# Altium project PCB_Project.PrjPcb
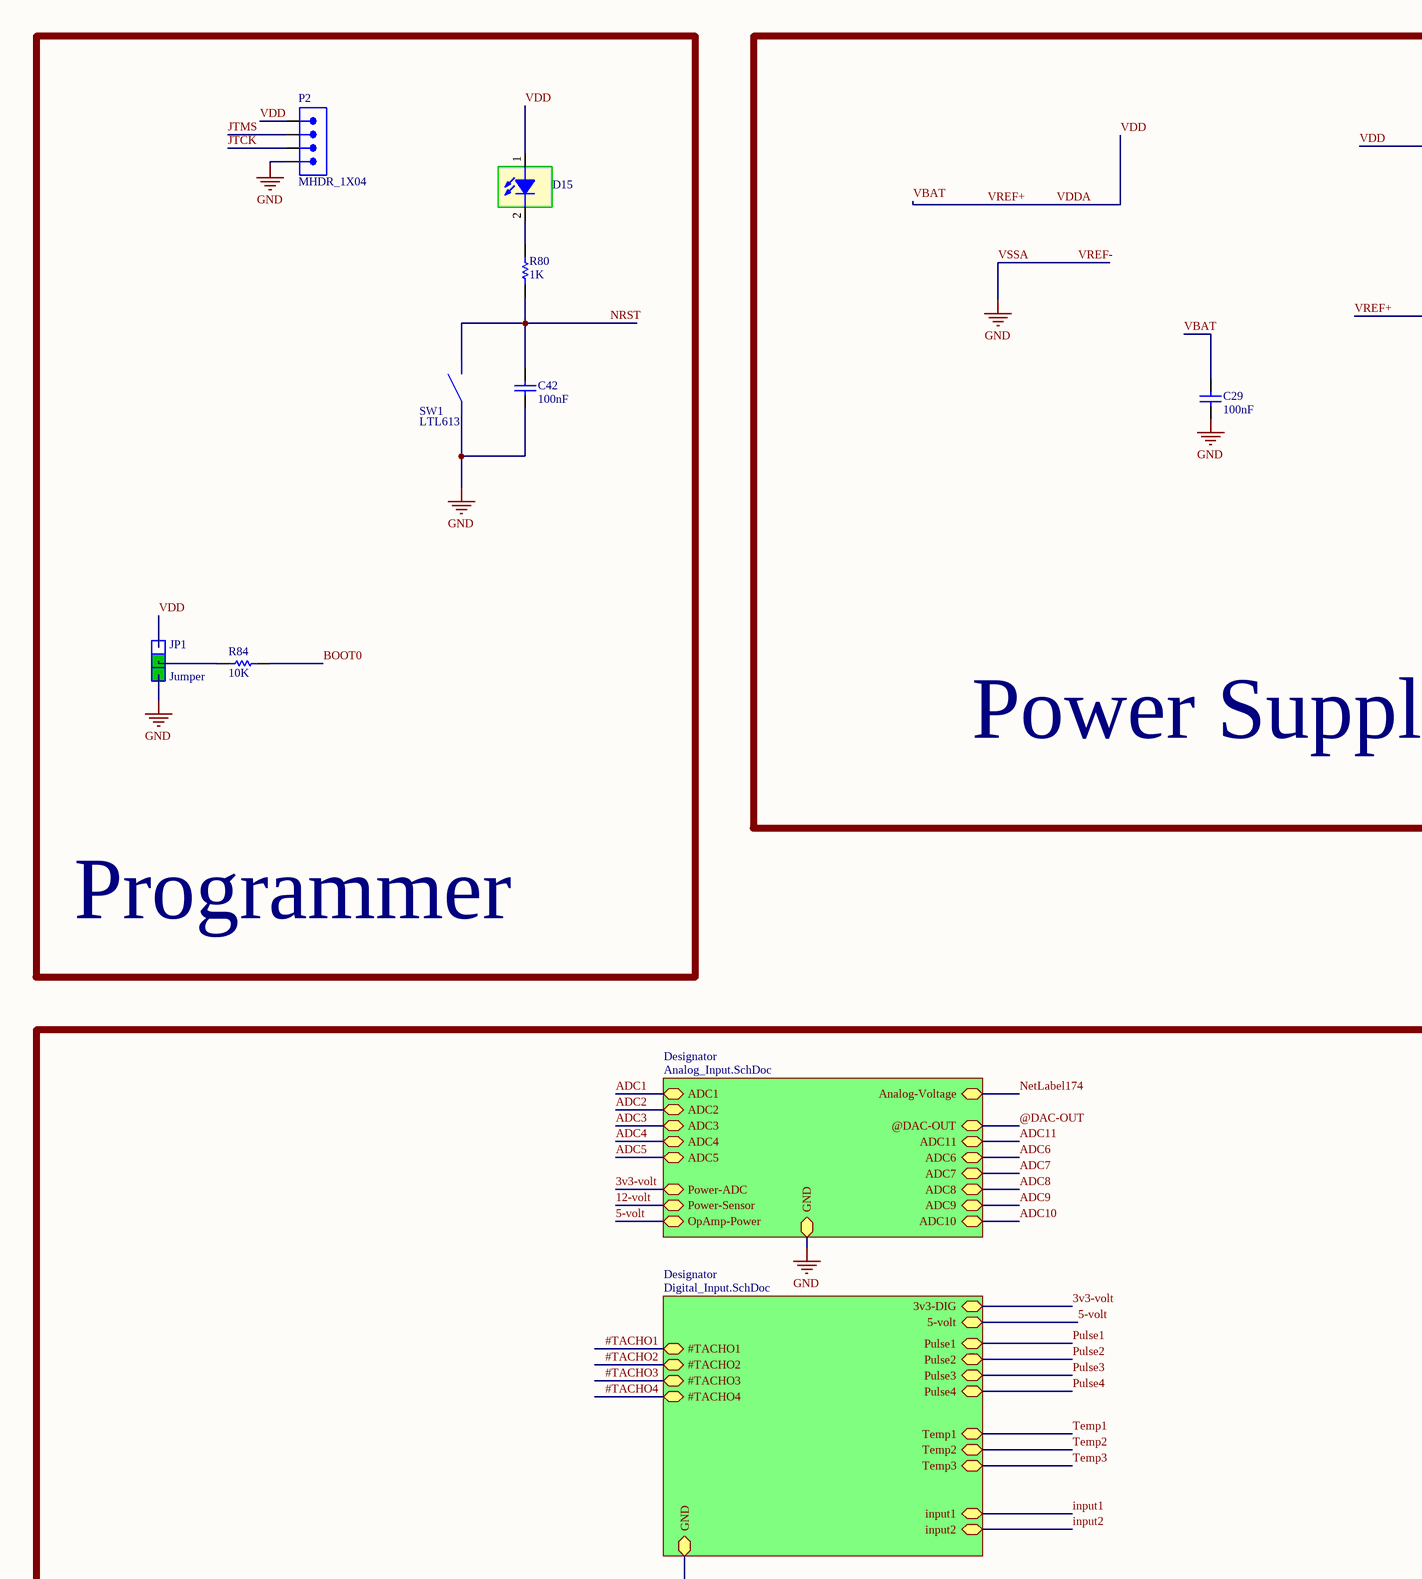
[diagram p0: Main.SchDoc, top left]
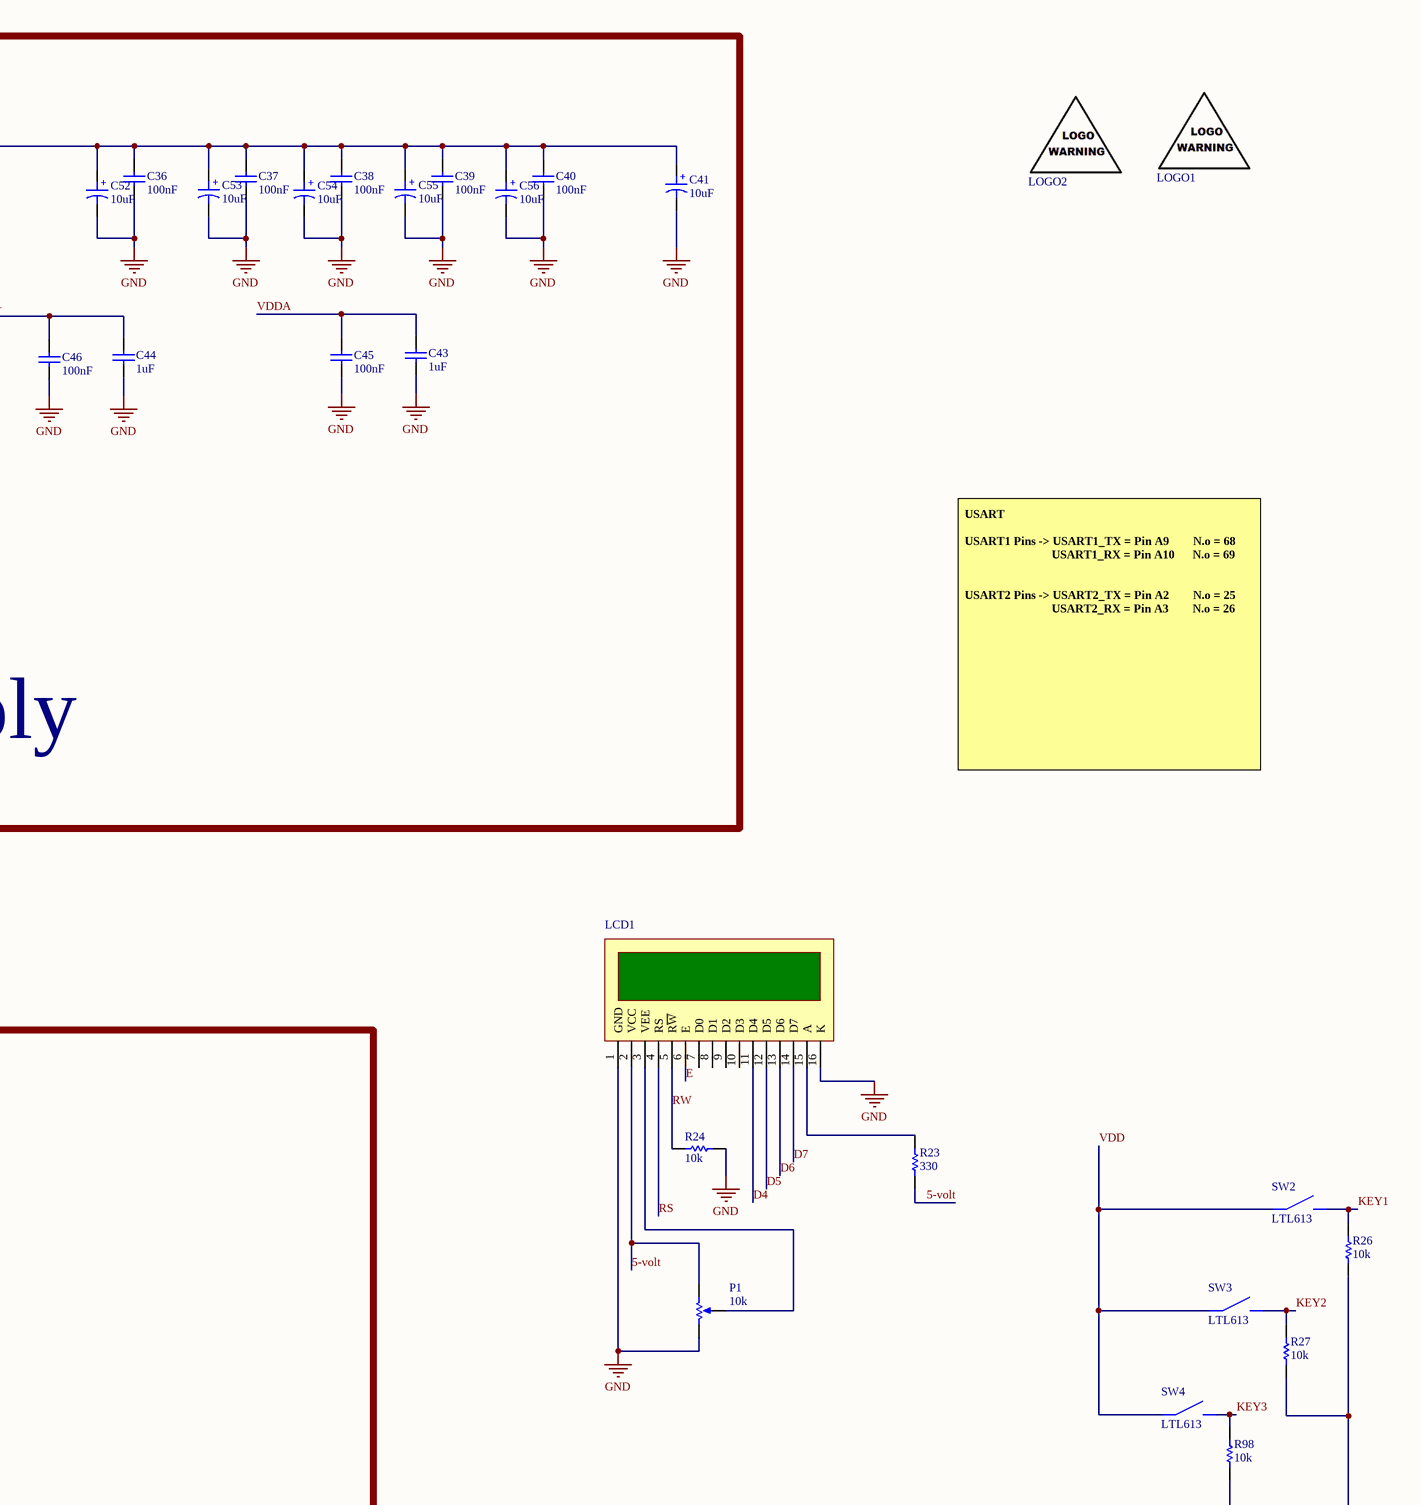
[diagram p1: Main.SchDoc, top right]
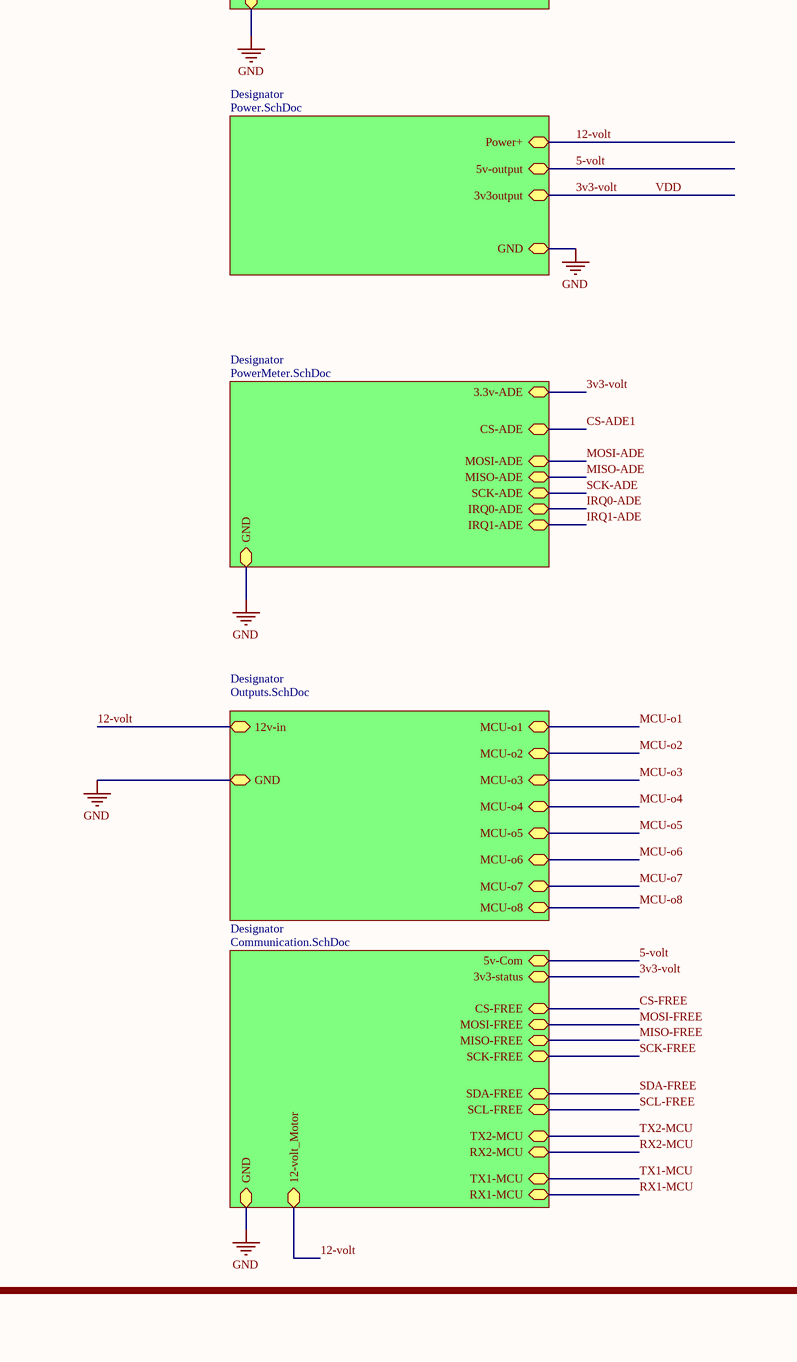
[diagram p2: Main.SchDoc, bottom left]
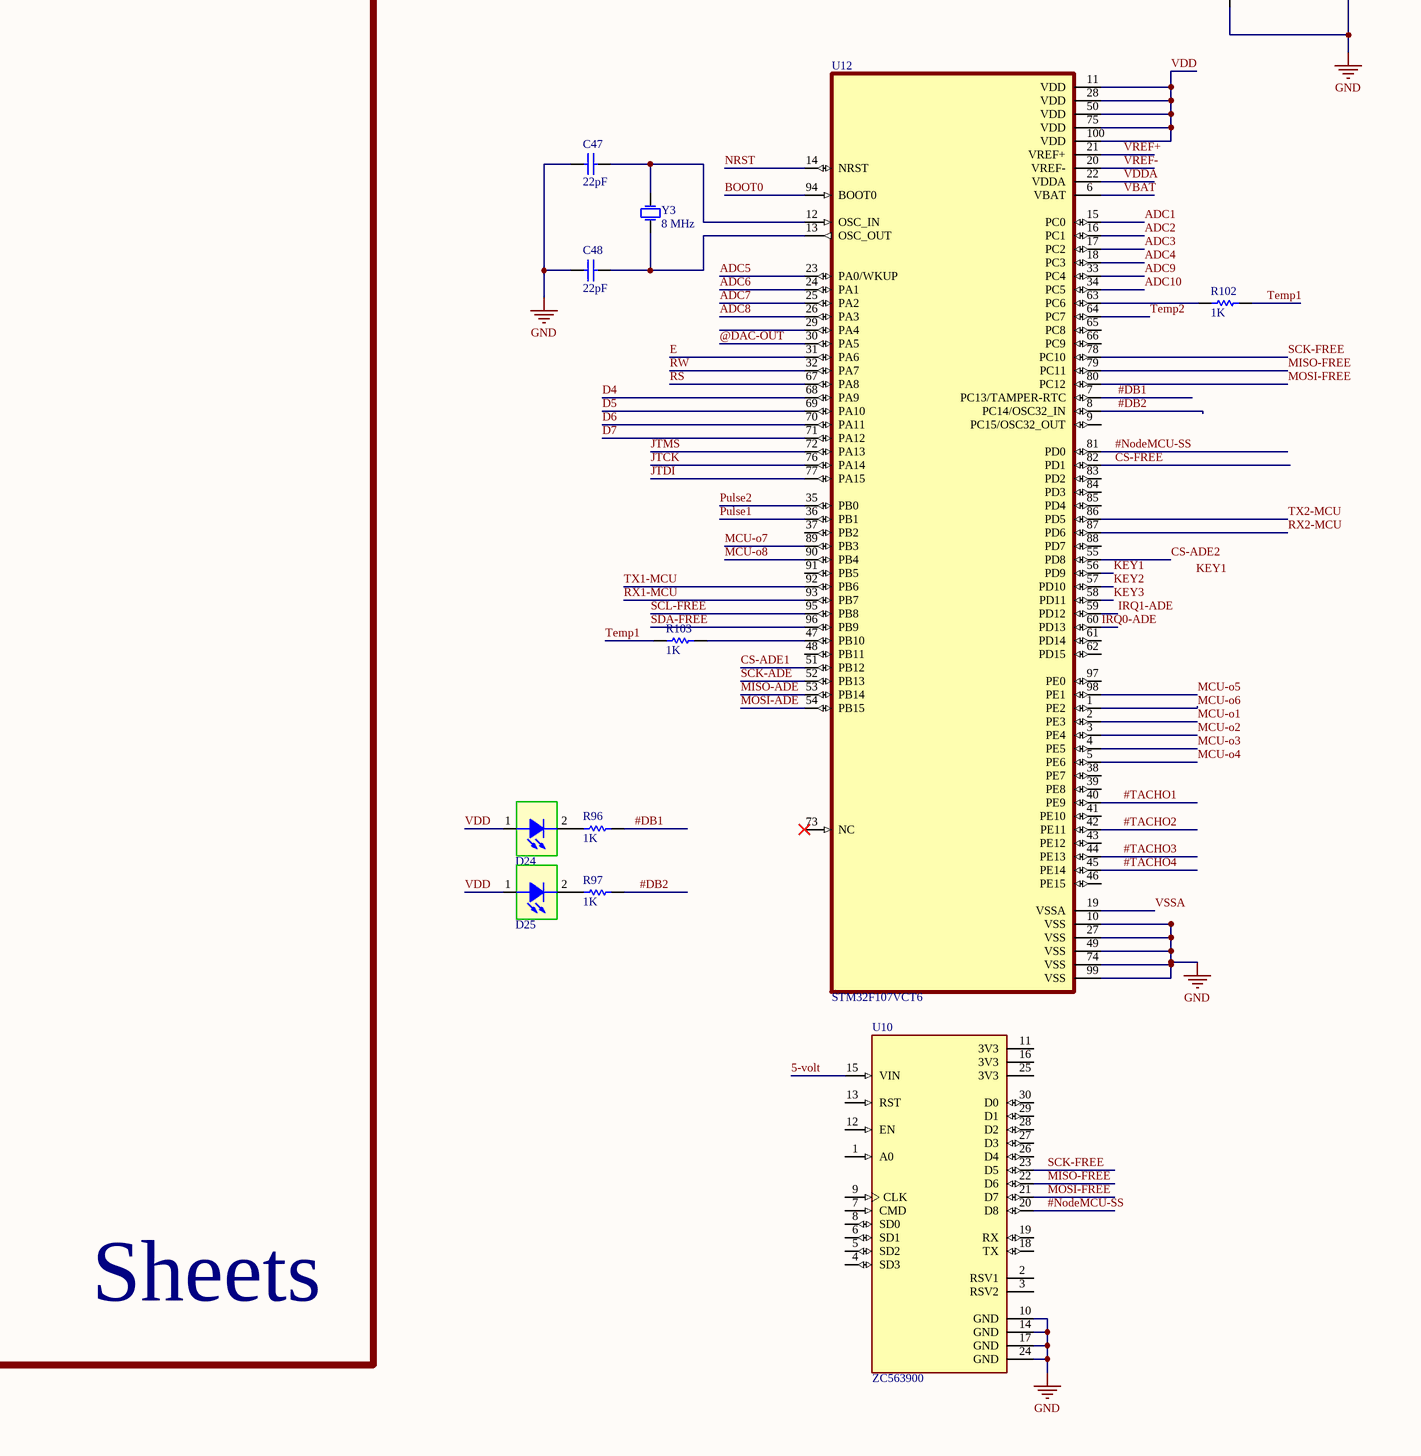
[diagram p3: Main.SchDoc, bottom right]
7 sheets, 298 parts. Net scope: hierarchical (ports join the sheet entries above them; power ports are global).
Board file: MainPCB.PcbDoc
Sheets:
  Main.SchDoc
    Designator = PowerMeter.SchDoc
    Designator = Outputs.SchDoc
    Designator = Analog_Input.SchDoc
    Designator = Digital_Input.SchDoc
    Designator = Power.SchDoc
    Designator = Communication.SchDoc

## Sheet Main.SchDoc
size 549 x 549 mm

### Parts
C29  100nF  [0805_C]
C36  100nF  [0805_C]
C37  100nF  [0805_C]
C38  100nF  [0805_C]
C39  100nF  [0805_C]
C40  100nF  [0805_C]
C41  10uF  [Cap1206_(3216X18L)Size A]
C42  100nF  [0805_C]
C43  1uF  [0805_C]
C44  1uF  [0805_C]
C45  100nF  [0805_C]
C46  100nF  [0805_C]
C47  22pF  [CAPC3413X12N]
C48  22pF  [CAPC3413X12N]
C52  10uF  [Cap1206_(3216X18L)Size A]
C53  10uF  [Cap1206_(3216X18L)Size A]
C54  10uF  [Cap1206_(3216X18L)Size A]
C55  10uF  [Cap1206_(3216X18L)Size A]
C56  10uF  [Cap1206_(3216X18L)Size A]
D15  SMD 1206 LED  [LED 1206]  (value not drawn)
D24  SMD 1206 LED  [LED 1206]  (value not drawn)
D25  SMD 1206 LED  [LED 1206]  (value not drawn)
JP1  Jumper  [jumper selector]
LCD1  LCD2x16  [LCD 2*16]  (value not drawn)
LOGO1  (no value)  [WARNING ESD]  (no BOM)
LOGO2  (no value)  [WARNING]  (no BOM)
P1  10k  [Multi-Turn]
P2  MHDR_1X04  [MHDR1X04-254P]
R23  330  [RESC3413X04N]
R24  10k  [RESC3413X04N]
R26  10k  [RESC3413X04N]
R27  10k  [RESC3413X04N]
R80  1K  [RESC3413X04N]
R84  10K  [RESC3413X04N]
R96  1K  [RESC3413X04N]
R97  1K  [RESC3413X04N]
R98  10k  [RESC3413X04N]
R102  1K  [RESC3413X04N]
R103  1K  [RESC3413X04N]
SW1  LTL613  [pb-kfc-3x6x5]
SW2  LTL613  [LTL613]
SW3  LTL613  [LTL613]
SW4  LTL613  [LTL613]
U10  ZC563900  [MODULE_ZC563900]
U12  STM32F107VCT6  [QFP50P1600X1600X160-100N]
Y3  8 MHz  [Crystal SMD]

### Blocks framed on the sheet
Programmer: C42 D15 JP1 P2 R80 R84 SW1
Power Supply: C29 C36-C41 C43-C46 C52-C56

### Sub-sheets
Designator = PowerMeter.SchDoc: 3.3v-ADE (bidir), CS-ADE (bidir), MOSI-ADE (bidir), MISO-ADE (bidir), SCK-ADE (bidir), GND (bidir), IRQ0-ADE (bidir), IRQ1-ADE (bidir)
Designator = Outputs.SchDoc: MCU-o1 (bidir), MCU-o2 (bidir), MCU-o4 (bidir), MCU-o5 (bidir), MCU-o6 (bidir), MCU-o7 (bidir), 12v-in (bidir), GND (bidir), MCU-o3 (bidir), MCU-o8 (bidir)
Designator = Analog_Input.SchDoc: ADC1 (bidir), ADC2 (bidir), ADC3 (bidir), ADC4 (bidir), ADC5 (bidir), GND (bidir), Analog-Voltage (bidir), ADC10 (bidir), ADC9 (bidir), ADC8 (bidir), ADC7 (bidir), ADC6 (bidir), ADC11 (bidir), OpAmp-Power (bidir), Power-Sensor (bidir), Power-ADC (bidir), @DAC-OUT (bidir)
Designator = Digital_Input.SchDoc: Pulse1 (bidir), Pulse2 (bidir), Pulse3 (bidir), Pulse4 (bidir), Temp1 (bidir), Temp2 (bidir), Temp3 (bidir), input1 (bidir), input2 (bidir), GND (bidir), 3v3-DIG (bidir), 5-volt (bidir), #TACHO1 (bidir), #TACHO2 (bidir), #TACHO3 (bidir), #TACHO4 (bidir)
Designator = Power.SchDoc: Power+ (bidir), 5v-output (bidir), 3v3output (bidir), GND (bidir)
Designator = Communication.SchDoc: 5v-Com (bidir), RX1-MCU (bidir), TX1-MCU (bidir), RX2-MCU (bidir), TX2-MCU (bidir), SCK-FREE (bidir), MISO-FREE (bidir), MOSI-FREE (bidir), CS-FREE (bidir), SCL-FREE (bidir), SDA-FREE (bidir), GND (bidir), 3v3-status (bidir), 12-volt_Motor (bidir)

### Nets
VREF-: C29.1 C36.1 C37.1 C38.1 C39.1 C40.1 C41.2 C42.1 C43.1 C44.1 C45.1 C46.1 C47.2 C48.2 C52.2 C53.2 C54.2 C55.2 C56.2 JP1.1 LCD1.1(GND) LCD1.16(K) P1.3(BOT) P2.4 R24.2 R26.1 R27.1 R98.1 SW1.0 U10.10(GND) U10.14(GND) U10.17(GND) U10.24(GND) U12.10(VSS) U12.19(VSSA) U12.20(VREF-) U12.27(VSS) U12.49(VSS) U12.74(VSS) U12.99(VSS) ; sheet Designator/GND, sheet Designator/GND, sheet Designator/GND, sheet Designator/GND, sheet Designator/GND, sheet Designator/GND  [also labelled GND, VSSA]
3v3-volt: C29.2 C36.2 C37.2 C38.2 C39.2 C40.2 C41.1 C43.2 C44.2 C45.2 C46.2 C52.1 C53.1 C54.1 C55.1 C56.1 D15.1 D24.1 D25.1 JP1.3 P2.1 SW2.2 SW3.2 SW4.2 U12.6(VBAT) U12.11(VDD) U12.21(VREF+) U12.22(VDDA) U12.28(VDD) U12.50(VDD) U12.75(VDD) U12.100(VDD) ; sheet Designator/3.3v-ADE, sheet Designator/Power-ADC, sheet Designator/3v3-DIG, sheet Designator/3v3output, sheet Designator/3v3-status  [also labelled VBAT, VDD, VDDA, VREF+]  [project net 3.3v-ADE]
5-volt: LCD1.2(VCC) P1.1(TOP) R23.2 U10.15(VIN) ; sheet Designator/OpAmp-Power, sheet Designator/5-volt, sheet Designator/5v-output, sheet Designator/5v-Com
12-volt: sheet Designator/12v-in, sheet Designator/Power-Sensor, sheet Designator/Power+, sheet Designator/12-volt_Motor
#DB1: R96.1 U12.7(PC13/TAMPER-RTC)
#DB2: R97.1 U12.8(PC14/OSC32_IN)
#NodeMCU-SS: U10.20(D8) U12.81(PD0)
#TACHO1: U12.40(PE9) ; sheet Designator/#TACHO1
#TACHO2: U12.42(PE11) ; sheet Designator/#TACHO2
#TACHO3: U12.44(PE13) ; sheet Designator/#TACHO3
#TACHO4: U12.45(PE14) ; sheet Designator/#TACHO4
@DAC-OUT: U12.30(PA5) ; sheet Designator/@DAC-OUT
ADC1: U12.15(PC0) ; sheet Designator/ADC1
ADC2: U12.16(PC1) ; sheet Designator/ADC2
ADC3: U12.17(PC2) ; sheet Designator/ADC3
ADC4: U12.18(PC3) ; sheet Designator/ADC4
ADC5: U12.23(PA0/WKUP) ; sheet Designator/ADC5
ADC6: U12.24(PA1) ; sheet Designator/ADC6
ADC7: U12.25(PA2) ; sheet Designator/ADC7
ADC8: U12.26(PA3) ; sheet Designator/ADC8
ADC9: U12.33(PC4) ; sheet Designator/ADC9
ADC10: U12.34(PC5) ; sheet Designator/ADC10
ADC11: sheet Designator/ADC11
BOOT0: R84.2 U12.94(BOOT0)
CS-ADE1: U12.51(PB12) ; sheet Designator/CS-ADE  [project net CS-ADE]
CS-ADE2: U12.55(PD8)
CS-FREE: U12.82(PD1) ; sheet Designator/CS-FREE
D4: LCD1.11(D4) U12.68(PA9)
D5: LCD1.12(D5) U12.69(PA10)
D6: LCD1.13(D6) U12.70(PA11)
D7: LCD1.14(D7) U12.71(PA12)
E: LCD1.6(E) U12.31(PA6)
input1: sheet Designator/input1
input2: sheet Designator/input2
IRQ0-ADE: U12.60(PD13) ; sheet Designator/IRQ0-ADE
IRQ1-ADE: U12.59(PD12) ; sheet Designator/IRQ1-ADE
JTCK: P2.3 U12.76(PA14)
JTDI: U12.77(PA15)
JTMS: P2.2 U12.72(PA13)
KEY1: R26.2 SW2.1 U12.56(PD9)
KEY2: R27.2 SW3.1 U12.57(PD10)
KEY3: R98.2 SW4.1 U12.58(PD11)
MCU-o1: U12.2(PE3) ; sheet Designator/MCU-o1
MCU-o2: U12.3(PE4) ; sheet Designator/MCU-o2
MCU-o3: U12.4(PE5) ; sheet Designator/MCU-o3
MCU-o4: U12.5(PE6) ; sheet Designator/MCU-o4
MCU-o5: U12.98(PE1) ; sheet Designator/MCU-o5
MCU-o6: U12.1(PE2) ; sheet Designator/MCU-o6
MCU-o7: U12.89(PB3) ; sheet Designator/MCU-o7
MCU-o8: U12.90(PB4) ; sheet Designator/MCU-o8
MISO-ADE: U12.53(PB14) ; sheet Designator/MISO-ADE
MISO-FREE: U10.22(D6) U12.79(PC11) ; sheet Designator/MISO-FREE
MOSI-ADE: U12.54(PB15) ; sheet Designator/MOSI-ADE
MOSI-FREE: U10.21(D7) U12.80(PC12) ; sheet Designator/MOSI-FREE
NetLabel174: sheet Designator/Analog-Voltage
NRST: C42.2 R80.1 SW1.1 U12.14(NRST)
Pulse1: U12.36(PB1) ; sheet Designator/Pulse1
Pulse2: U12.35(PB0) ; sheet Designator/Pulse2
Pulse3: sheet Designator/Pulse3
Pulse4: sheet Designator/Pulse4
RS: LCD1.4(RS) U12.67(PA8)
RW: LCD1.5(R~{W}) R24.1 U12.32(PA7)
RX1-MCU: U12.93(PB7) ; sheet Designator/RX1-MCU
RX2-MCU: U12.87(PD6) ; sheet Designator/RX2-MCU
SCK-ADE: U12.52(PB13) ; sheet Designator/SCK-ADE
SCK-FREE: U10.23(D5) U12.78(PC10) ; sheet Designator/SCK-FREE
SCL-FREE: U12.95(PB8) ; sheet Designator/SCL-FREE
SDA-FREE: U12.96(PB9) ; sheet Designator/SDA-FREE
Temp1: R102.1 R103.1 ; sheet Designator/Temp1
Temp2: U12.64(PC7) ; sheet Designator/Temp2
Temp3: sheet Designator/Temp3
TX1-MCU: U12.92(PB6) ; sheet Designator/TX1-MCU
TX2-MCU: U12.86(PD5) ; sheet Designator/TX2-MCU
NetC47_1: C47.1 U12.12(OSC_IN) Y3.2(OSC2)
NetC48_1: C48.1 U12.13(OSC_OUT) Y3.1(OSC1)
NetD15_2: D15.2 R80.2
NetD24_2: D24.2 R96.2
NetD25_2: D25.2 R97.2
NetJP1_2: JP1.2 R84.1
NetLCD1_3: LCD1.3(VEE) P1.2(TAP)
NetLCD1_15: LCD1.15(A) R23.1
NetR102_2: R102.2 U12.63(PC6)
NetR103_2: R103.2 U12.47(PB10)

Not connected (* = marked no-connect by the designer): LCD1 7(D0) 8(D1) 9(D2) 10(D3); U10 1(A0) 2(RSV1) 3(RSV2) 4(SD3) 5(SD2) 6(SD1) 7(CMD) 8(SD0) 9(CLK) 11(3V3) 12(EN) 13(RST) 16(3V3) 18(TX) 19(RX) 25(3V3) 26(D4) 27(D3) 28(D2) 29(D1) 30(D0); U12 9(PC15/OSC32_OUT) 29(PA4) 37(PB2) 38(PE7) 39(PE8) 41(PE10) 43(PE12) 46(PE15) 48(PB11) 61(PD14) 62(PD15) 65(PC8) 66(PC9) 73(NC)* 83(PD2) 84(PD3) 85(PD4) 88(PD7) 91(PB5) 97(PE0)

### Notes on the sheet
- USART
  USART1 Pins -> USART1_TX = Pin A9        N.o = 68
  USART1_RX = Pin A10      N.o = 69
  USART2 Pins -> USART2_TX = Pin A2        N.o = 25
  USART2_RX = Pin A3        N.o = 26
- Sheets
- Labels drawn without touching a wire or pin: KEY1
- (in symbol Cap ELECTROLITIC TOTAL SIZE) +

### Library data of the parts
C29 C36-C40 C42 C45-C48 = CAP SMD 0805: CAP 0805; Designer: Abbas Basereh; Desc.: CAP SMD 0805; Data: 16-12-2016
C41 C52-C56 = Cap ELECTROLITIC TOTAL SIZE: Cap electrolitic radial; Designer: Abbas Basereh; VALUE: 1uF; Data: 16-12-2016; Part. No: *
C43 C44 = CAP SMD 1206: CAP 1206; Designer: Abbas Basereh; Desc.: CAP SMD 1206; Data: 16-12-2016
D15 D24 D25 = LED SMD 1206
JP1 = Jumper Selector
LOGO1 LOGO2 = Graphical_WARNINGS: WARNING & LOGO; Company: SJ Libraries; Designer: Eng. Saeid Jorablo; Mounting Technology: Surface Mount\Through-Hole; ComponentLink1Description: Datasheet; Pin Count: 0; Update Date: 6/3/2012; Category: MISC; HelpURL: http://s3.picofile.com/file/7443264187/Coming_Soon_logo.gif
P1 = Multi-Turn: Potentiometer
P2 = MHDR_1X04: Male Header 1X04
R23 R24 R26 R27 R80 R84 R96-R98 R102 R103 = RES 0805 0.125W: RES 0805; Designer: Abbas Basereh; Desc.: RES SMD 0805; Data: 16-12-2016
SW1-SW4 = Button_tact: Tact button switch
U10 = ZC563900: NodeMcu Lua ESP8266 WIFI Internet of Things Network Development Module Board; MF: YKS; MP: ZC563900; Package: None; Price: None; Availability: Unavailable; Value: *; SnapEDA_Link: https://www.snapeda.com/parts/ZC563900/YKS/view-part/607853/?ref=snap
U12 = STM32F107VCT6: ARMÂ® CortexÂ®-M3 STM32F1 Microcontroller IC 32-Bit 72MHz 256KB _256K x 8_ FLASH; MF: STMicroelectronics; Package: LQFP-100 STMicroelectronics; Value: *; Price: None; MP: STM32F107VCT6; SnapEDA_Link: https://www.snapeda.com/parts/STM32F107VCT6/STMicroelectronics/view-part/46316/?ref=snap; Availability: Unavailable
Y3 = XTAL: XTAL Crystal; Designer: ABBAS BASEREH; Value: 12 MHz; Design Date: 2017-1-3; ComponentLink1Description: Datasheet; ComponentLink2Description: Reference; Mounting Technology: Surface Mount\Through-Hole; Status: Unreleased

## Sheet PowerMeter.SchDoc
size A3 portrait
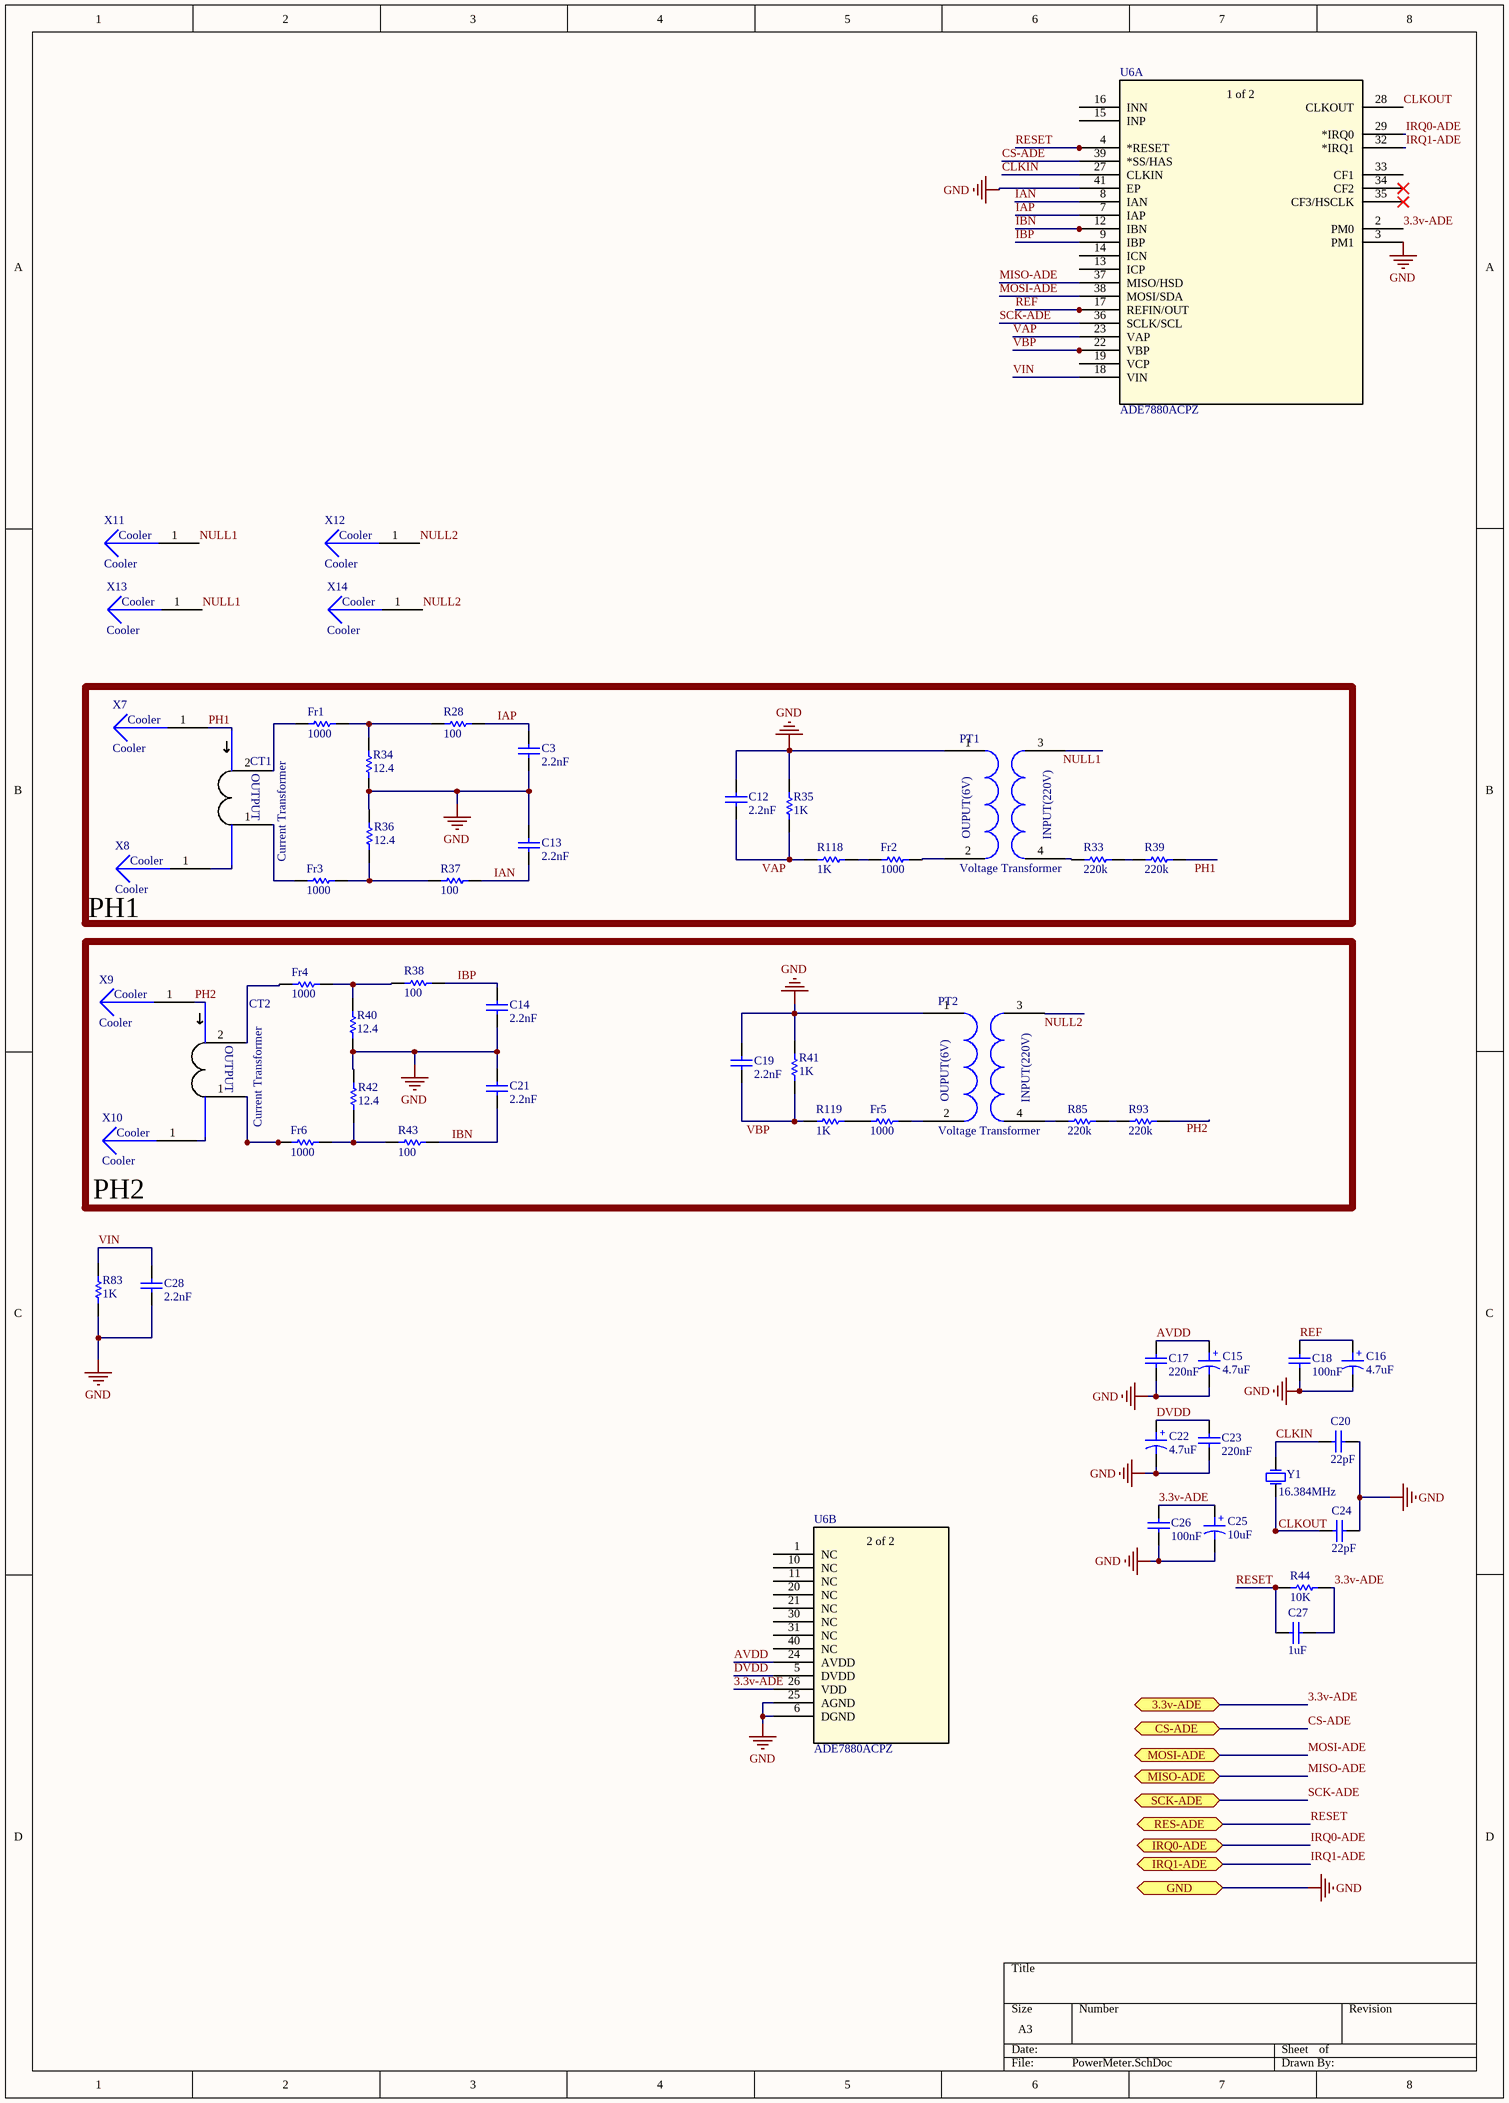
[diagram p4: PowerMeter.SchDoc]

### Parts
C3  2.2nF  [CAPC3413X12N]
C12  2.2nF  [CAPC3413X12N]
C13  2.2nF  [CAPC3413X12N]
C14  2.2nF  [CAPC3413X12N]
C15  4.7uF  [CAPP 1206 (3216X18L) Size A]
C16  4.7uF  [CAPP 1206 (3216X18L) Size A]
C17  220nF  [CAPC3413X12N]
C18  100nF  [CAPC3413X12N]
C19  2.2nF  [CAPC3413X12N]
C20  22pF  [CAPC3413X12N]
C21  2.2nF  [CAPC3413X12N]
C22  4.7uF  [CAPP 1206 (3216X18L) Size A]
C23  220nF  [CAPC3413X12N]
C24  22pF  [CAPC3413X12N]
C25  10uF  [CAPP 1206 (3216X18L) Size A]
C26  100nF  [CAPC3413X12N]
C27  1uF  [CAPC3413X12N]
C28  2.2nF  [CAPC3413X12N]
CT1  Current Transformer  [Current Transformer_60/0.06]
CT2  Current Transformer  [Current Transformer_60/0.06]
Fr1  1000  [RESC3413X04N]
Fr2  1000  [RESC3413X04N]
Fr3  1000  [RESC3413X04N]
Fr4  1000  [RESC3413X04N]
Fr5  1000  [RESC3413X04N]
Fr6  1000  [RESC3413X04N]
PT1  Voltage Transformer  [Isolated Voltage Transformer]
PT2  Voltage Transformer  [Isolated Voltage Transformer]
R28  100  [RESC3413X04N]
R33  value 220k  [RES2512]  (hidden comment: Resistor)
R34  12.4  [RESC3413X04N]
R35  1K  [RESC3413X04N]
R36  12.4  [RESC3413X04N]
R37  100  [RESC3413X04N]
R38  100  [RESC3413X04N]
R39  value 220k  [RES2512]  (hidden comment: Resistor)
R40  12.4  [RESC3413X04N]
R41  1K  [RESC3413X04N]
R42  12.4  [RESC3413X04N]
R43  100  [RESC3413X04N]
R44  10K  [RESC3413X04N]
R83  1K  [RESC3413X04N]
R85  value 220k  [RES2512]  (hidden comment: Resistor)
R93  value 220k  [RES2512]  (hidden comment: Resistor)
R118  1K  [RESC3413X04N]
R119  1K  [RESC3413X04N]
U6  ADE7880ACPZ  [CP_40_10_ADI]  (parts A,B of 2)
X7  Cooler  [Cooler]
X8  Cooler  [Cooler]
X9  Cooler  [Cooler]
X10  Cooler  [Cooler]
X11  Cooler  [Cooler]
X12  Cooler  [Cooler]
X13  Cooler  [Cooler]
X14  Cooler  [Cooler]
Y1  16.384MHz  [Crystal SMD]

### Blocks framed on the sheet
PH1: C3 C12 C13 CT1 Fr1-Fr3 PT1 R28 R33-R37 R39 R118 X7 X8
PH2: C14 C19 C21 CT2 Fr4-Fr6 PT2 R38 R40-R43 R85 R93 R119 X9 X10

### Ports
3.3v-ADE (bidir), CS-ADE (bidir), GND (bidir), IRQ0-ADE (bidir), IRQ1-ADE (bidir), MISO-ADE (bidir), MOSI-ADE (bidir), RES-ADE (bidir), SCK-ADE (bidir)

### Nets
GND: C3.1 C12.1 C13.1 C14.1 C15.2 C16.2 C17.1 C18.1 C19.1 C20.1 C21.1 C22.2 C23.1 C24.1 C25.2 C26.1 C28.1 PT1.1(OUT_1) PT2.1(OUT_1) R34.2 R35.1 R36.1 R40.2 R41.1 R42.1 R83.1 U6.3(PM1) U6.6(DGND) U6.25(AGND) U6.41(EP) ; port GND  [project net VREF-]
3.3v-ADE: C25.1 C26.2 C27.1 R44.2 U6.2(PM0) U6.26(VDD) ; port 3.3v-ADE
AVDD: C15.1 C17.2 U6.24(AVDD)
CLKIN: C20.2 U6.27(CLKIN) Y1.2(OSC2)
CLKOUT: C24.2 U6.28(CLKOUT) Y1.1(OSC1)
CS-ADE: U6.39(*SS/HAS) ; port CS-ADE
DVDD: C22.1 C23.2 U6.5(DVDD)
IAN: C13.2 R37.2 U6.8(IAN)
IAP: C3.2 R28.2 U6.7(IAP)
IBN: C21.2 R43.2 U6.12(IBN)
IBP: C14.2 R38.2 U6.9(IBP)
IRQ0-ADE: U6.29(*IRQ0) ; port IRQ0-ADE
IRQ1-ADE: U6.32(*IRQ1) ; port IRQ1-ADE
MISO-ADE: U6.37(MISO/HSD) ; port MISO-ADE
MOSI-ADE: U6.38(MOSI/SDA) ; port MOSI-ADE
NULL1: PT1.3(IN_1) X11.1 X13.1
NULL2: PT2.3(IN_1) X12.1 X14.1
PH1: CT1.4 R39.2 X7.1
PH2: CT2.4 R93.2 X9.1
REF: C16.1 C18.2 U6.17(REFIN/OUT)
RESET: C27.2 R44.1 U6.4(*RESET) ; port RES-ADE
SCK-ADE: U6.36(SCLK/SCL) ; port SCK-ADE
VAP: C12.2 R35.2 R118.1 U6.23(VAP)
VBP: C19.2 R41.2 R119.1 U6.22(VBP)
VIN: C28.2 R83.2 U6.18(VIN)
NetCT1_1: CT1.1(IN) Fr3.1
NetCT1_2: CT1.2(OUT) Fr1.1
NetCT1_3: CT1.3 X8.1
NetCT2_1: CT2.1(IN) Fr6.1
NetCT2_2: CT2.2(OUT) Fr4.1
NetCT2_3: CT2.3 X10.1
NetFr1_2: Fr1.2 R28.1 R34.1
NetFr2_1: Fr2.1 PT1.2(OUT_2)
NetFr2_2: Fr2.2 R118.2
NetFr3_2: Fr3.2 R36.2 R37.1
NetFr4_2: Fr4.2 R38.1 R40.1
NetFr5_1: Fr5.1 PT2.2(OUT_2)
NetFr5_2: Fr5.2 R119.2
NetFr6_2: Fr6.2 R42.2 R43.1
NetPT1_4: PT1.4(IN_2) R33.2
NetPT2_4: PT2.4(IN_2) R85.2
NetR33_1: R33.1 R39.1
NetR85_1: R85.1 R93.1

Not connected (* = marked no-connect by the designer): U6 1(NC) 10(NC) 11(NC) 13(ICP) 14(ICN) 15(INP) 16(INN) 19(VCP) 20(NC) 21(NC) 30(NC) 31(NC) 33(CF1) 34(CF2)* 35(CF3/HSCLK)* 40(NC)

### Notes on the sheet
- (in symbol ADE7880ACPZ, part A) 1 of 2
- (in symbol ADE7880ACPZ, part B) 2 of 2
- (in symbol Cap ELECTROLITIC TOTAL SIZE) +
- (in symbol Current Transformer) OUTPUT
- (in symbol Voltage Transformer) INPUT(220V); OUPUT(6V)

### Library data of the parts
C3 C12-C14 C17-C21 C23 C24 C26-C28 = CAP SMD 0805: CAP 0805; Designer: Abbas Basereh; Desc.: CAP SMD 0805; Data: 16-12-2016
C15 C16 C22 C25 = Cap ELECTROLITIC TOTAL SIZE: as C41 on sheet Main; Data: 16-12-2016; Part. No: *
Fr1-Fr6 R28 R34-R38 R40-R44 R83 R118 R119 = RES 0805 0.125W: as R23 on sheet Main; Data: 16-12-2016
U6 = ADE7880ACPZ: No Description Available; Mfr_Name: Analog Devices Inc; Copyright: Copyright (C) 2022 Ultra Librarian. All rights reserved.; Manufacturer_Part_Number: ADE7880ACPZ; RefDes: RefDes; Type: DEV
Y1 = XTAL: as Y3 on sheet Main; Design Date: 2017-1-3; ComponentLink1Description: Datasheet; ComponentLink2Description: Reference; Mounting Technology: Surface Mount\Through-Hole; Status: Unreleased

## Sheet Outputs.SchDoc
size A1
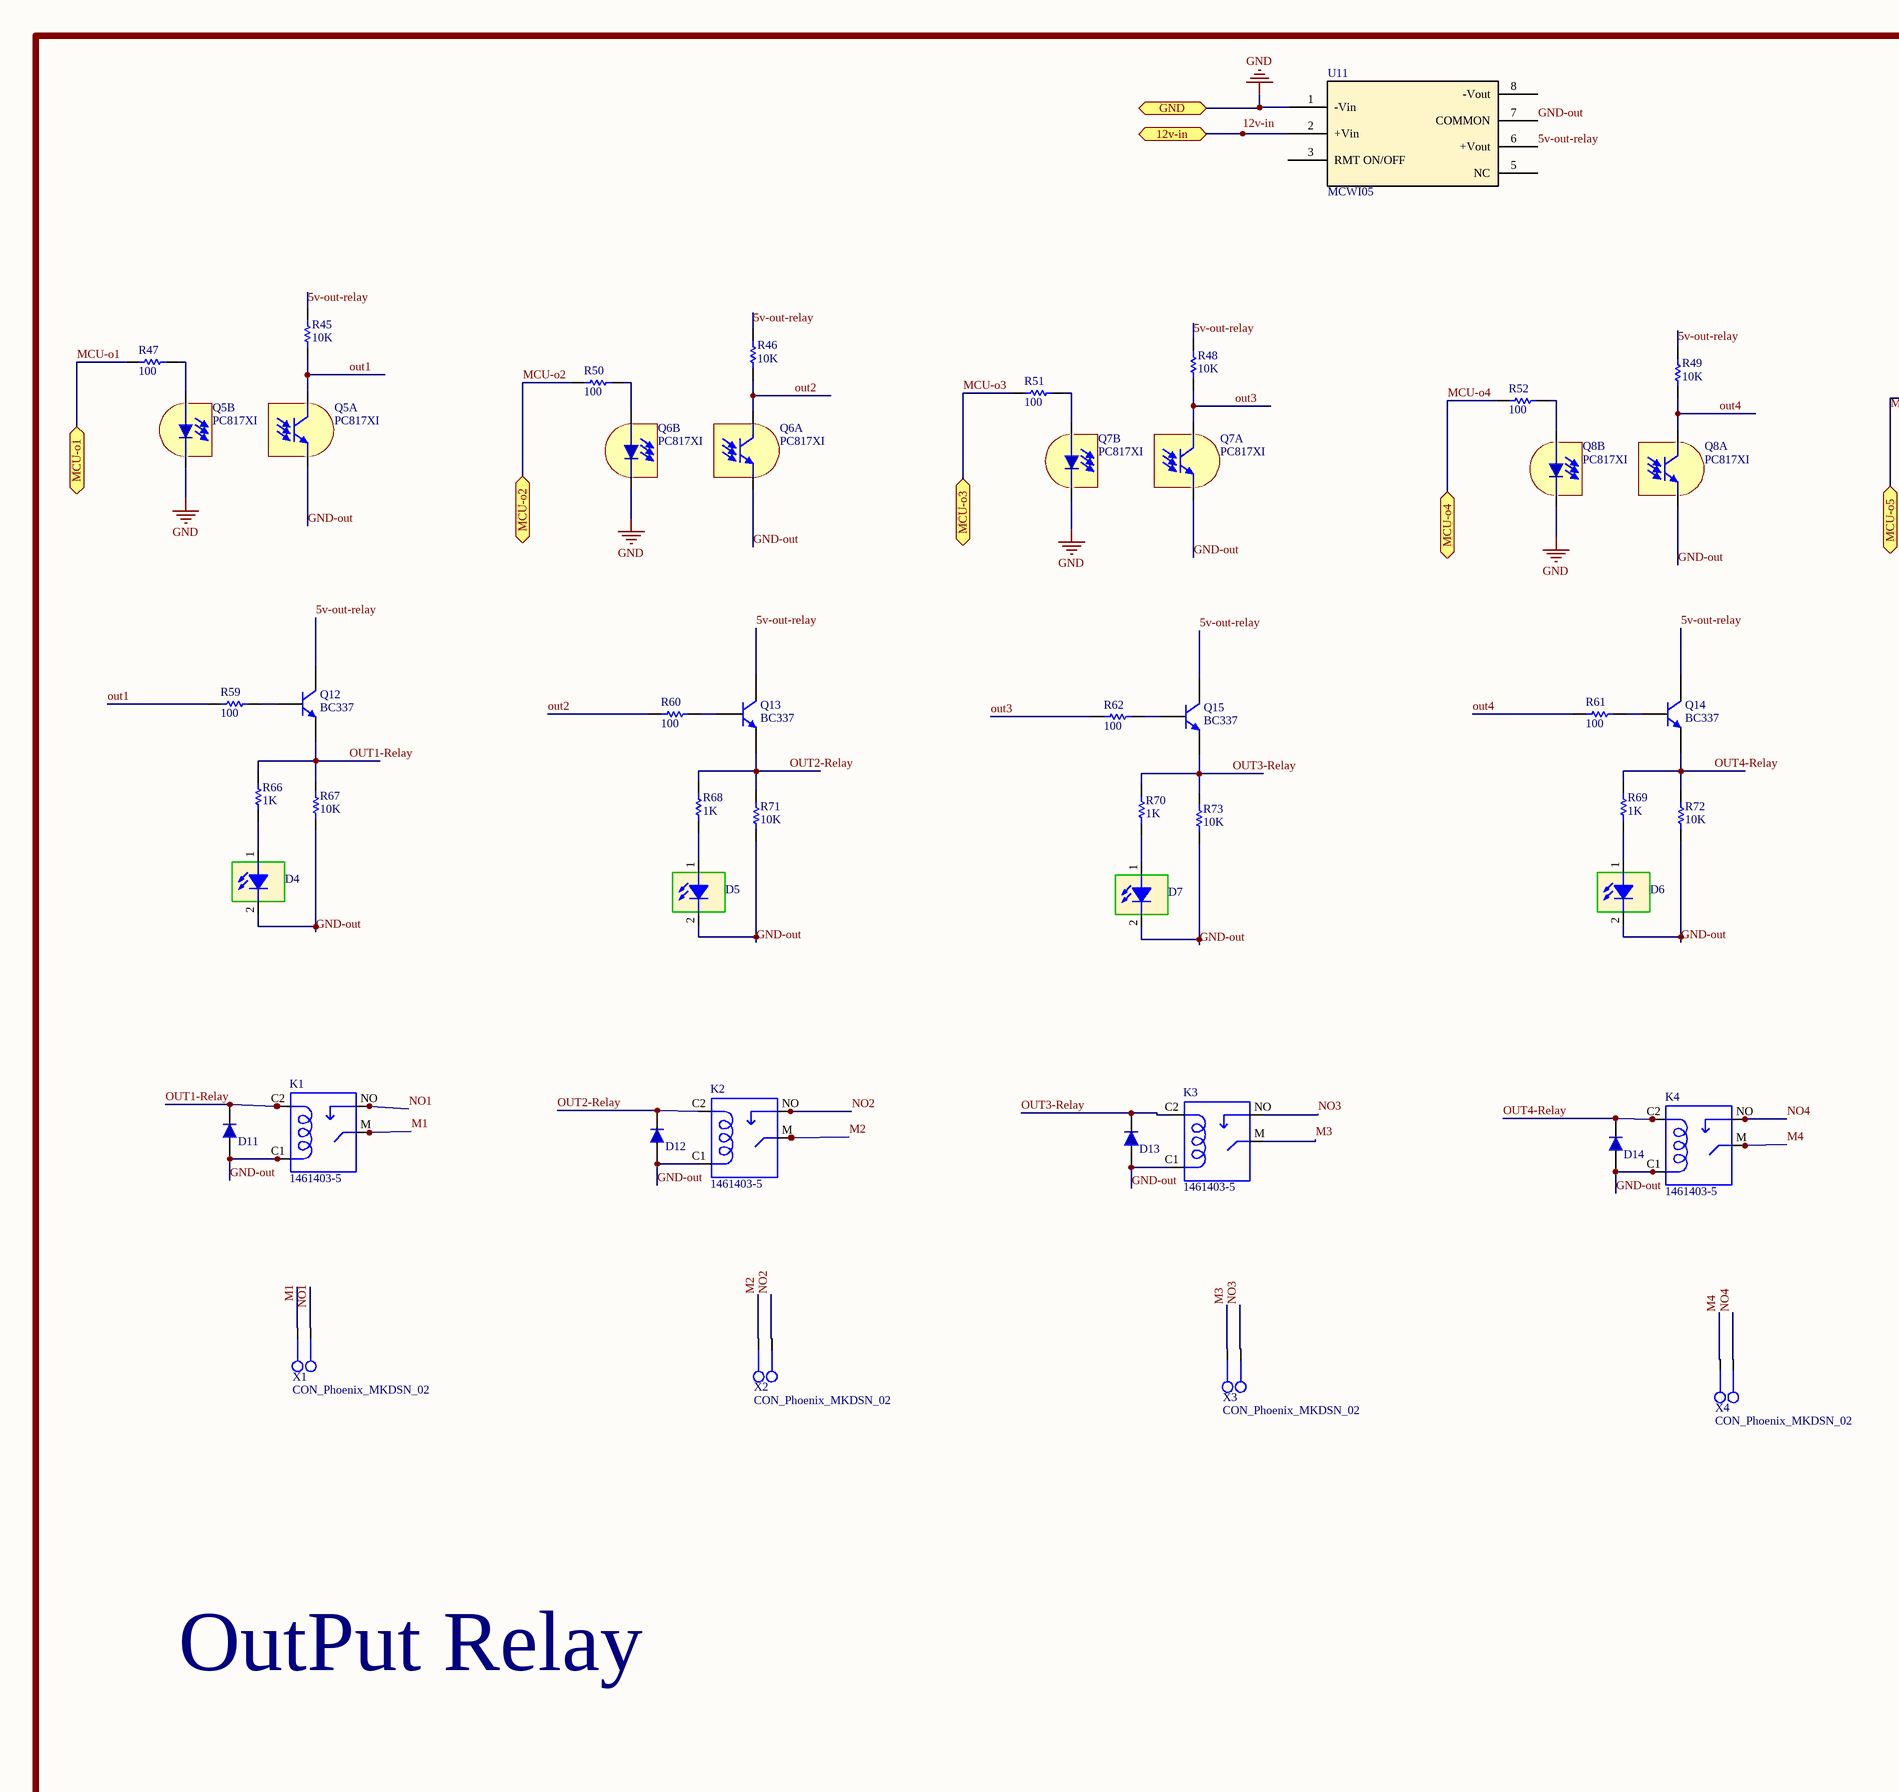
[diagram p5: Outputs.SchDoc, left]
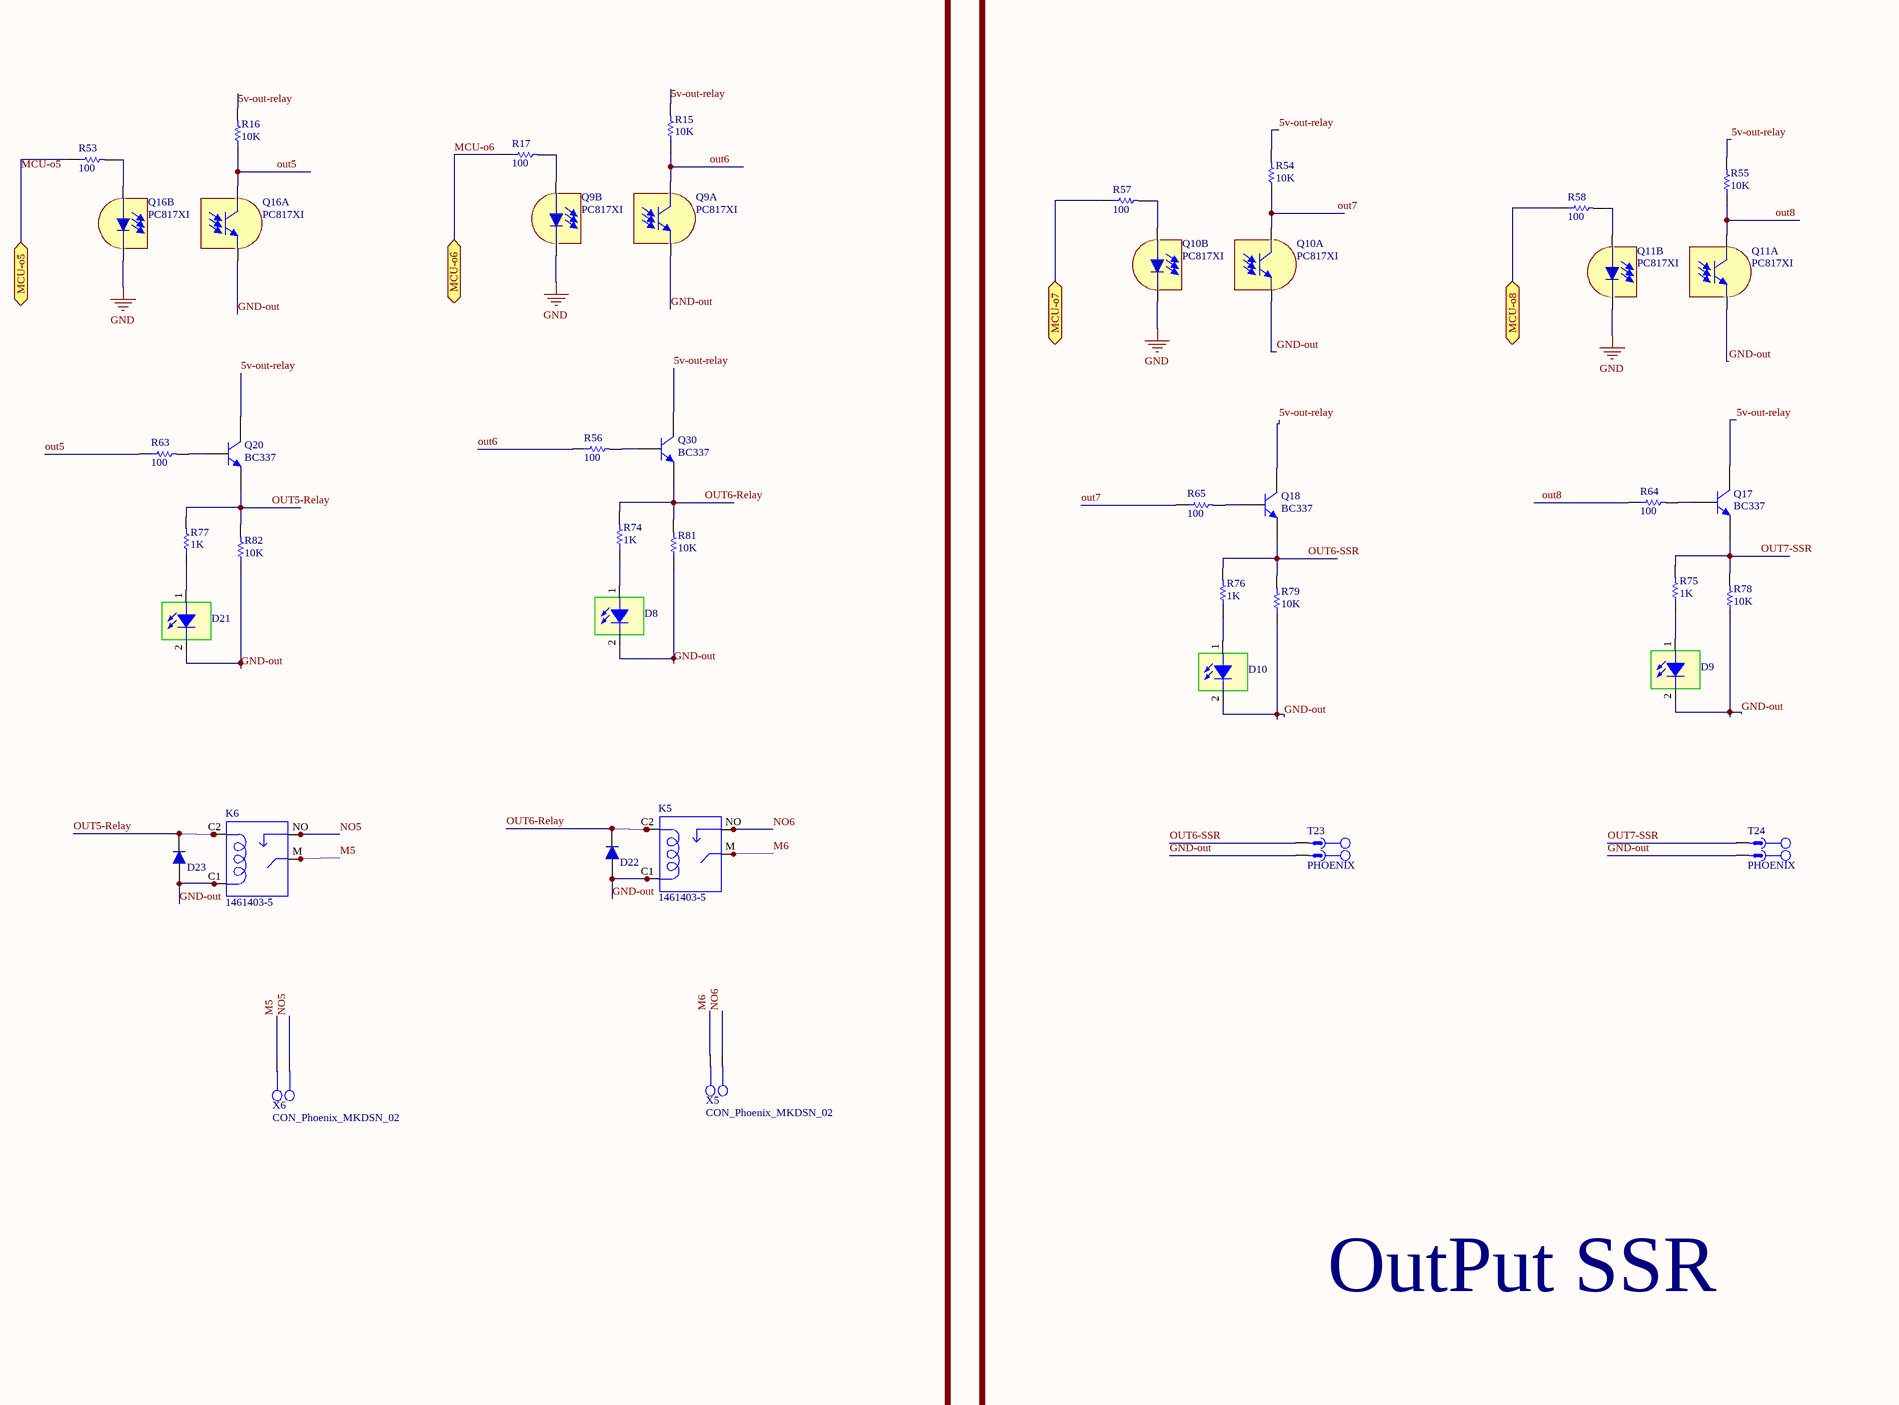
[diagram p6: Outputs.SchDoc, right]

### Parts
D4  SMD 1206 LED  [LED 1206]  (value not drawn)
D5  SMD 1206 LED  [LED 1206]  (value not drawn)
D6  SMD 1206 LED  [LED 1206]  (value not drawn)
D7  SMD 1206 LED  [LED 1206]  (value not drawn)
D8  SMD 1206 LED  [LED 1206]  (value not drawn)
D9  SMD 1206 LED  [LED 1206]  (value not drawn)
D10  SMD 1206 LED  [LED 1206]  (value not drawn)
D11  1n4007  [DIOM4629X24N]  (value not drawn)
D12  1n4007  [DIOM4629X24N]  (value not drawn)
D13  1n4007  [DIOM4629X24N]  (value not drawn)
D14  1n4007  [DIOM4629X24N]  (value not drawn)
D21  SMD 1206 LED  [LED 1206]  (value not drawn)
D22  1n4007  [DIOM4629X24N]  (value not drawn)
D23  1n4007  [DIOM4629X24N]  (value not drawn)
K1  1461403-5  [Miniature_Relay]
K2  1461403-5  [Miniature_Relay]
K3  1461403-5  [Miniature_Relay]
K4  1461403-5  [Miniature_Relay]
K5  1461403-5  [Miniature_Relay]
K6  1461403-5  [Miniature_Relay]
Q5  PC817XI  [SMT Gullwing Lead-Form]  (parts A,B of 2)
Q6  PC817XI  [SMT Gullwing Lead-Form]  (parts A,B of 2)
Q7  PC817XI  [SMT Gullwing Lead-Form]  (parts A,B of 2)
Q8  PC817XI  [SMT Gullwing Lead-Form]  (parts A,B of 2)
Q9  PC817XI  [SMT Gullwing Lead-Form]  (parts A,B of 2)
Q10  PC817XI  [SMT Gullwing Lead-Form]  (parts A,B of 2)
Q11  PC817XI  [SMT Gullwing Lead-Form]  (parts A,B of 2)
Q12  BC337  [SOT23_M]
Q13  BC337  [SOT23_M]
Q14  BC337  [SOT23_M]
Q15  BC337  [SOT23_M]
Q16  PC817XI  [SMT Gullwing Lead-Form]  (parts A,B of 2)
Q17  BC337  [SOT23_M]
Q18  BC337  [SOT23_M]
Q20  BC337  [SOT23_M]
Q30  BC337  [SOT23_M]
R15  10K  [RESC3413X04N]
R16  10K  [RESC3413X04N]
R17  100  [RESC3413X04N]
R45  10K  [RESC3413X04N]
R46  10K  [RESC3413X04N]
R47  100  [RESC3413X04N]
R48  10K  [RESC3413X04N]
R49  10K  [RESC3413X04N]
R50  100  [RESC3413X04N]
R51  100  [RESC3413X04N]
R52  100  [RESC3413X04N]
R53  100  [RESC3413X04N]
R54  10K  [RESC3413X04N]
R55  10K  [RESC3413X04N]
R56  100  [RESC3413X04N]
R57  100  [RESC3413X04N]
R58  100  [RESC3413X04N]
R59  100  [RESC3413X04N]
R60  100  [RESC3413X04N]
R61  100  [RESC3413X04N]
R62  100  [RESC3413X04N]
R63  100  [RESC3413X04N]
R64  100  [RESC3413X04N]
R65  100  [RESC3413X04N]
R66  1K  [RESC3413X04N]
R67  10K  [RESC3413X04N]
R68  1K  [RESC3413X04N]
R69  1K  [RESC3413X04N]
R70  1K  [RESC3413X04N]
R71  10K  [RESC3413X04N]
R72  10K  [RESC3413X04N]
R73  10K  [RESC3413X04N]
R74  1K  [RESC3413X04N]
R75  1K  [RESC3413X04N]
R76  1K  [RESC3413X04N]
R77  1K  [RESC3413X04N]
R78  10K  [RESC3413X04N]
R79  10K  [RESC3413X04N]
R81  10K  [RESC3413X04N]
R82  10K  [RESC3413X04N]
T23  PHOENIX  [MSTB 2,5/2-G-5,08]
T24  PHOENIX  [MSTB 2,5/2-G-5,08]
U11  MCWI05  [MCWI05_PCB]
X1  CON_Phoenix_MKDSN_02  [MSTB 2,5/2-G-5,08]
X2  CON_Phoenix_MKDSN_02  [MSTB 2,5/2-G-5,08]
X3  CON_Phoenix_MKDSN_02  [MSTB 2,5/2-G-5,08]
X4  CON_Phoenix_MKDSN_02  [MSTB 2,5/2-G-5,08]
X5  CON_Phoenix_MKDSN_02  [MSTB 2,5/2-G-5,08]
X6  CON_Phoenix_MKDSN_02  [MSTB 2,5/2-G-5,08]

### Blocks framed on the sheet
OutPut Relay: D4-D8 D11-D14 D21-D23 K1-K6 Q5-Q9 Q12-Q16 Q20 Q30 R15-R17 R45-R53 R56 R59-R63 R66-R74 R77 R81 R82 U11 X1-X6
OutPut SSR: D9 D10 Q10 Q11 Q17 Q18 R54 R55 R57 R58 R64 R65 R75 R76 R78 R79 T23 T24

### Ports
12v-in (bidir), GND (bidir), MCU-o1 (bidir), MCU-o2 (bidir), MCU-o3 (bidir), MCU-o4 (bidir), MCU-o5 (bidir), MCU-o6 (bidir), MCU-o7 (bidir), MCU-o8 (bidir)

### Nets
GND: Q5.2(K) Q6.2(K) Q7.2(K) Q8.2(K) Q9.2(K) Q10.2(K) Q11.2(K) Q16.2(K) U11.1(-Vin) ; port GND  [project net VREF-]
5v-out-relay: Q12.3(C) Q13.3(C) Q14.3(C) Q15.3(C) Q17.3(C) Q18.3(C) Q20.3(C) Q30.3(C) R15.2 R16.2 R45.2 R46.2 R48.2 R49.2 R54.2 R55.2 U11.6(+Vout)
12v-in: U11.2(+Vin) ; port 12v-in  [project net 12-volt]
GND-out: D4.2 D5.2 D6.2 D7.2 D8.2 D9.2 D10.2 D11.1 D12.1 D13.1 D14.1 D21.2 D22.1 D23.1 K1.C1 K2.C1 K3.C1 K4.C1 K5.C1 K6.C1 Q5.3(E) Q6.3(E) Q7.3(E) Q8.3(E) Q9.3(E) Q10.3(E) Q11.3(E) Q16.3(E) R67.1 R71.1 R72.1 R73.1 R78.1 R79.1 R81.1 R82.1 T23.2 T24.2 U11.7(COMMON)
M1: K1.M X1.1
M2: K2.M X2.1
M3: K3.M X3.1
M4: K4.M X4.1
M5: K6.M X6.1
M6: K5.M X5.1
MCU-o1: R47.1 ; port MCU-o1
MCU-o2: R50.1 ; port MCU-o2
MCU-o3: R51.1 ; port MCU-o3
MCU-o4: R52.1 ; port MCU-o4
MCU-o5: R53.1 ; port MCU-o5
MCU-o6: R17.1 ; port MCU-o6
MCU-o7: R57.1 ; port MCU-o7
MCU-o8: R58.1 ; port MCU-o8
NO1: K1.NO X1.2
NO2: K2.NO X2.2
NO3: K3.NO X3.2
NO4: K4.NO X4.2
NO5: K6.NO X6.2
NO6: K5.NO X5.2
out1: Q5.4(C) R45.1 R59.1
OUT1-Relay: D11.2 K1.C2 Q12.2(E) R66.2 R67.2
out2: Q6.4(C) R46.1 R60.1
OUT2-Relay: D12.2 K2.C2 Q13.2(E) R68.2 R71.2
out3: Q7.4(C) R48.1 R62.1
OUT3-Relay: D13.2 K3.C2 Q15.2(E) R70.2 R73.2
out4: Q8.4(C) R49.1 R61.1
OUT4-Relay: D14.2 K4.C2 Q14.2(E) R69.2 R72.2
out5: Q16.4(C) R16.1 R63.1
OUT5-Relay: D23.2 K6.C2 Q20.2(E) R77.2 R82.2
out6: Q9.4(C) R15.1 R56.1
OUT6-Relay: D22.2 K5.C2 Q30.2(E) R74.2 R81.2
OUT6-SSR: Q18.2(E) R76.2 R79.2 T23.1
out7: Q10.4(C) R54.1 R65.1
OUT7-SSR: Q17.2(E) R75.2 R78.2 T24.1
out8: Q11.4(C) R55.1 R64.1
NetD4_1: D4.1 R66.1
NetD5_1: D5.1 R68.1
NetD6_1: D6.1 R69.1
NetD7_1: D7.1 R70.1
NetD8_1: D8.1 R74.1
NetD9_1: D9.1 R75.1
NetD10_1: D10.1 R76.1
NetD21_1: D21.1 R77.1
NetQ5_1: Q5.1(A) R47.2
NetQ6_1: Q6.1(A) R50.2
NetQ7_1: Q7.1(A) R51.2
NetQ8_1: Q8.1(A) R52.2
NetQ9_1: Q9.1(A) R17.2
NetQ10_1: Q10.1(A) R57.2
NetQ11_1: Q11.1(A) R58.2
NetQ12_1: Q12.1(B) R59.2
NetQ13_1: Q13.1(B) R60.2
NetQ14_1: Q14.1(B) R61.2
NetQ15_1: Q15.1(B) R62.2
NetQ16_1: Q16.1(A) R53.2
NetQ17_1: Q17.1(B) R64.2
NetQ18_1: Q18.1(B) R65.2
NetQ20_1: Q20.1(B) R63.2
NetQ30_1: Q30.1(B) R56.2

Not connected (* = marked no-connect by the designer): U11 3(RMT_ON/OFF) 5(NC) 8(-Vout)

### Library data of the parts
D4-D10 D21 = LED SMD 1206
D11-D14 D22 D23 = 1n4007 SMD M7: Standard Rectifiers; Part. No: M7; Manufacturer: DC COMPONENTS; Designer: Abbas Basereh; Link: http://www.tme.eu/en/details/m7/smd-universal-diodes/dc-components/; Link: https://www.aliexpress.com/item/Smd-tube-1n4007-m7-SMA/1213719741.html?spm=2114.01010208.3.1.ZyZ7bC&ws_ab_test=searchweb0_0,searchweb201602_4_10065_10068_10084_10083_10080_10082_10081_10060_10061_10062_10056_10055_10054_10059_10099_10078_10079_427_10073_10103_10102_10096_10052_10050_10051,searchweb201603_4&btsid=db2be5ca-e560-400a-b91c-484ab5ee228b; Data: 16-12-2016
K1-K6 = 1461403-5: Electromechanical Relay 24VDC 2.8KOhm 8A SPST-NO_18.2x10.2x14.7_mm THT Industrial Relay; MF: TE Connectivity; Price: None; Package: None; TE_purchase_URL: https://www.te.com/usa-en/product-1461403-5.html?te_bu=Cor&te_type=disp&te_campaign=seda_glo_cor-seda-global-disp-prtnr-fy19-seda-model-bom-cta_sma-317_1&elqCampaignId=32493; Value: *; MP: 1461403-5; Availability: Unavailable; SnapEDA_Link: https://www.snapeda.com/parts/1461403-5/TE%20Connectivity%20Potter%20%26%20Brumfield%20Relays/view-part/2370888/?ref=snap
Q5-Q11 Q16 = PC817XI: DIP 4pin General Purpose  Photocoupler; Published: 2017-2-27; DatasheetVersion: 2017-2-27; PackageVersion: 2017-2-27; PackageReference: SMT Gullwing Lead-Form; Publisher: Abbas Basereh; PackageDescription: SOP, 4-Leads, Body 4/65x6/75mm, Pitch 2/54mm, IPC Medium Density designer:abbas basereh; ComponentLink1Description: Manufacturer Link; ComponentLink1URL: http://www.roboeq.ir/files/id/233/name/PC817.pdf/; ComponentLink2Description: DIP 4pin General Purpose
Q12-Q15 Q17 Q18 Q20 Q30 = BC337: 45 V, 500 mA NPN general-purpose transistors; Published: 2017-2-8; LatestRevisionDate: 2017; LatestRevisionNote: IPC-7351 Footprint Added.; DatasheetVersion: 2017; PackageVersion: 2017-2-8; PackageReference: SOT23; Publisher: Abbas Basereh; PackageDescription: 3-Pin SOT-23 Package 0.95 mm Pitch, 2.3 mm Lead Span; ComponentLink1Description: Manufacturer Link; ComponentLink1URL: http://www.nxp.com/; ComponentLink2Description: Datasheet; ComponentLink2URL: http://www.nxp.com/
R15-R17 R45-R79 R81 R82 = RES
T23 T24 = CON_Phoenix_MSTB_02: 2 Pitch: 5.08 mm Color: green Contact surface: Tin Assembly; Manufacturer: PHOENIX CONTACT; Connector type: PCB Terminal Block; designer: ABBAS BASEREH; Max Current: 12 A; Positions: 2; Voltage: 320 V; Category: Connector; ComponentLink1Description: Header, Nominal current: 12 A Rated voltage (III/2): 320 V Number of positions: 2 Pitch: 5.08 mm Color: green Contact surface: Tin Assembly: Soldering  DESIGNER:ABBAS BASEREH; ComponentLink2Description: Reference; Mounting Technology: Through-Hole; Pin Count: 2; Revision 1: 2017-3-1; Status: Unreleased; PART.NO: PHOENIX
X1-X6 = CON_Phoenix_MKDSN_02: Manufacturer: PHOENIX CONTACT; Company: SJ Libraries; Connector type: PCB Terminal Block; designer: Eng. Saeid Jorablo; Max Current: 13.5 A; Positions: 2; Revision 1: 2012/10/1 : Adding Model; Voltage: 400 V; Category: Connector; ComponentLink1Description: Datasheet; ComponentLink2Description: Reference; HelpURL: http://s3.picofile.com/file/7443264187/Coming_Soon_logo.gif; Mounting Technology: Through-Hole; Pin Count: 2; Publisher: SJ UnLimited; Status: Unreleased; Update: 2012/10/1

## Sheet Analog_Input.SchDoc
size A1 portrait
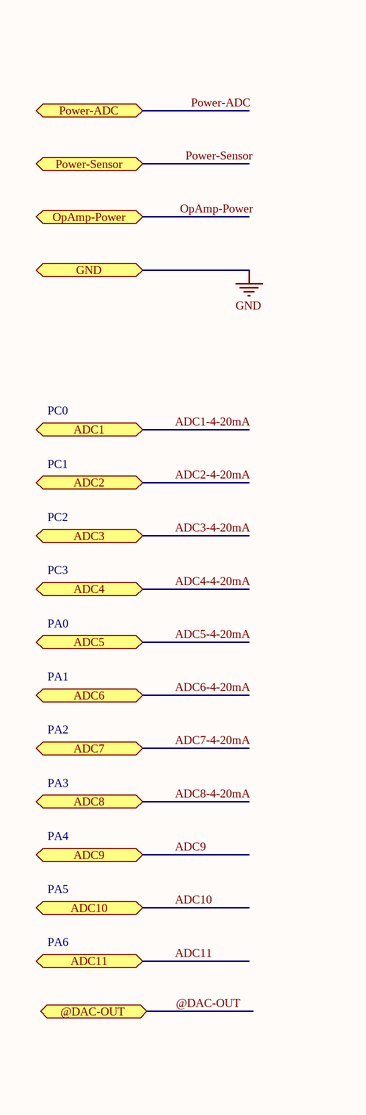
[diagram p7: Analog_Input.SchDoc, top left]
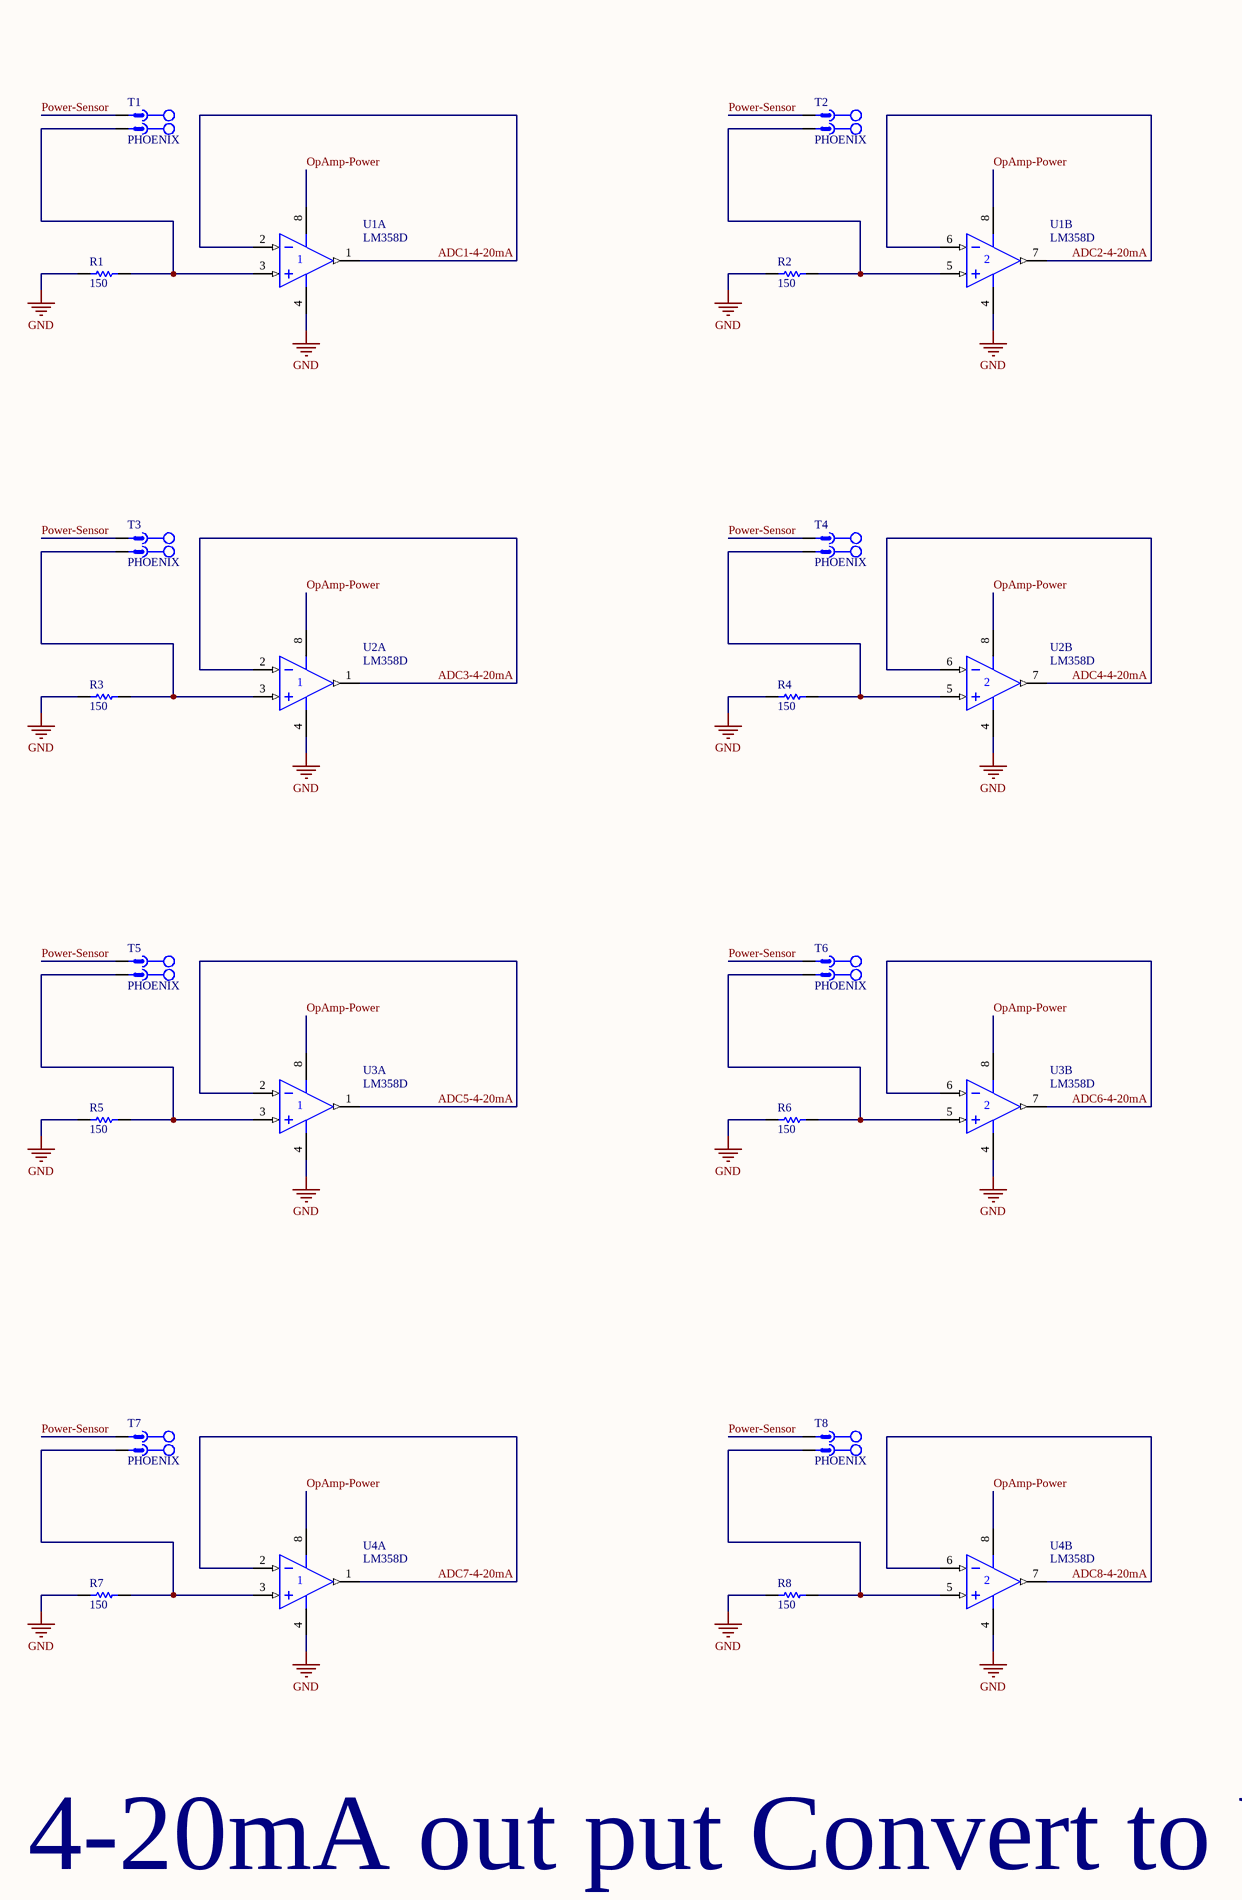
[diagram p8: Analog_Input.SchDoc, top right]
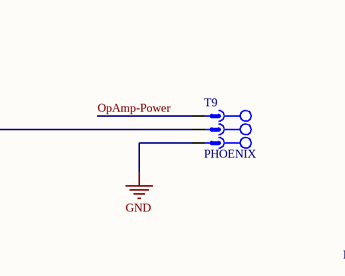
[diagram p9: Analog_Input.SchDoc, bottom left]
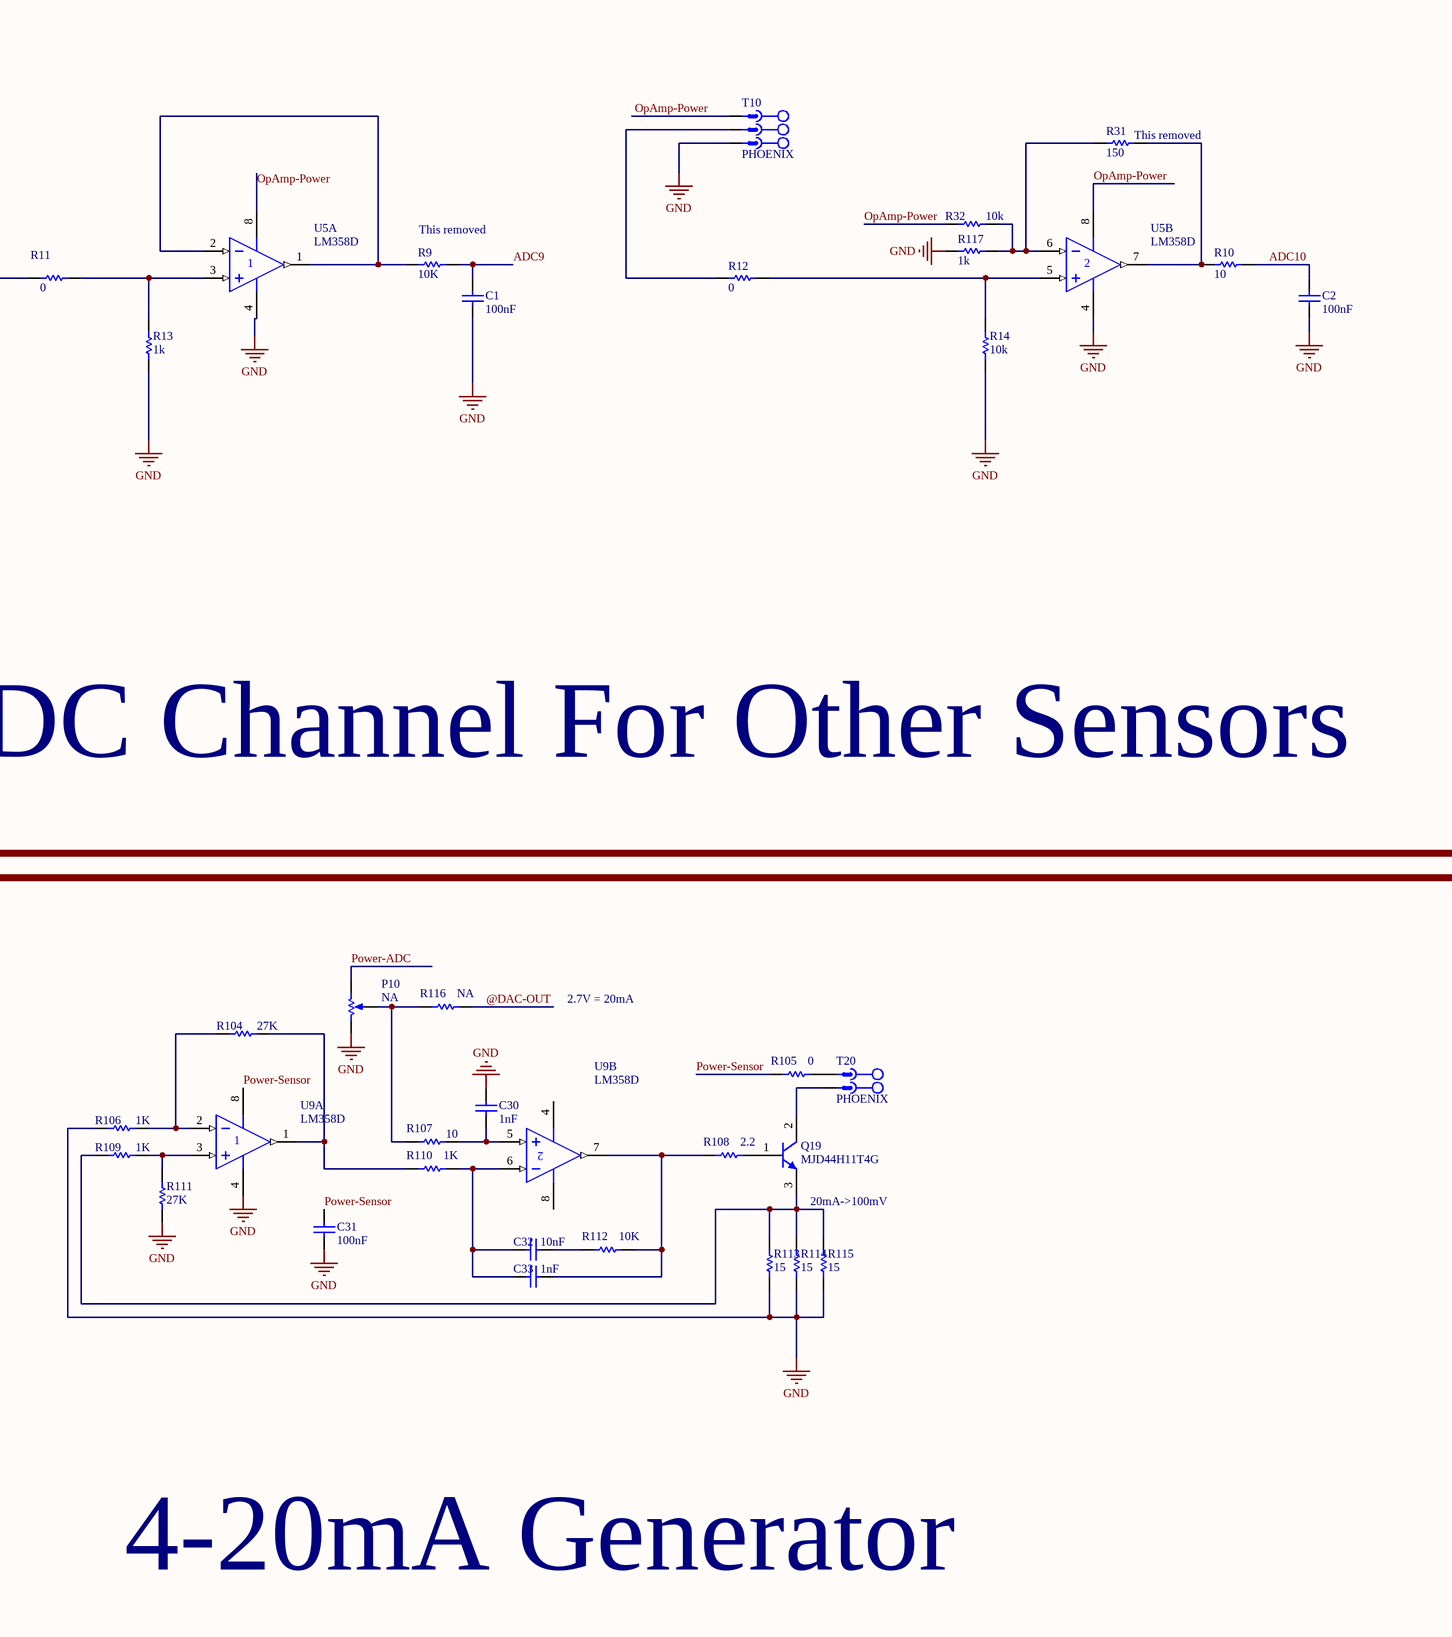
[diagram p10: Analog_Input.SchDoc, bottom right]

### Parts
C1  100nF  [CAPC3413X12N]
C2  100nF  [CAPC3413X12N]
C30  1nF  [CAPC3413X12N]
C31  100nF  [CAPC3413X12N]
C32  10nF  [CAPC3413X12N]
C33  1nF  [CAPC3413X12N]
P10  NA  [Multi Turn 02]
Q19  MJD44H11T4G  [DPACK-SMD]
R1  150  [RESC3413X04N]
R2  150  [RESC3413X04N]
R3  150  [RESC3413X04N]
R4  150  [RESC3413X04N]
R5  150  [RESC3413X04N]
R6  150  [RESC3413X04N]
R7  150  [RESC3413X04N]
R8  150  [RESC3413X04N]
R9  10K  [RESC3413X04N]
R10  10  [RESC3413X04N]
R11  0  [RESC3413X04N]
R12  0  [RESC3413X04N]
R13  1k  [RESC3413X04N]
R14  10k  [RESC3413X04N]
R31  150  [RESC3413X04N]
R32  10k  [RESC3413X04N]
R104  27K  [RESC3413X04N]
R105  0  [RESC3413X04N]
R106  1K  [RESC3413X04N]
R107  10  [RESC3413X04N]
R108  2.2  [RESC3413X04N]
R109  1K  [RESC3413X04N]
R110  1K  [RESC3413X04N]
R111  27K  [RESC3413X04N]
R112  10K  [RESC3413X04N]
R113  15  [RESC3413X04N]
R114  15  [RESC3413X04N]
R115  15  [RESC3413X04N]
R116  NA  [RESC3413X04N]
R117  1k  [RESC3413X04N]
T1  PHOENIX  [MSTB 2,5/2-G-5,08]
T2  PHOENIX  [MSTB 2,5/2-G-5,08]
T3  PHOENIX  [MSTB 2,5/2-G-5,08]
T4  PHOENIX  [MSTB 2,5/2-G-5,08]
T5  PHOENIX  [MSTB 2,5/2-G-5,08]
T6  PHOENIX  [MSTB 2,5/2-G-5,08]
T7  PHOENIX  [MSTB 2,5/2-G-5,08]
T8  PHOENIX  [MSTB 2,5/2-G-5,08]
T9  PHOENIX  [MSTB 2,5/3-G-5,08]
T10  PHOENIX  [MSTB 2,5/3-G-5,08]
T20  PHOENIX  [MSTB 2,5/2-G-5,08]
U1  LM358D  [SO-8_N]  (parts A,B of 2)
U2  LM358D  [SO-8_N]  (parts A,B of 2)
U3  LM358D  [SO-8_N]  (parts A,B of 2)
U4  LM358D  [SO-8_N]  (parts A,B of 2)
U5  LM358D  [SO-8_N]  (parts A,B of 2)
U9  LM358D  [SO-8_N]  (parts A,B of 2)

### Blocks framed on the sheet
Sensors 4-20mA out put Convert to Voltage: R1-R8 T1-T8 U1-U4
ADC Channel For Other Sensors: C1 C2 R9-R14 R31 R32 R117 T9 T10 U5
4-20mA Generator: C30-C33 P10 Q19 R104-R116 T20 U9

### Ports
@DAC-OUT (bidir), ADC1 (bidir), ADC2 (bidir), ADC3 (bidir), ADC4 (bidir), ADC5 (bidir), ADC6 (bidir), ADC7 (bidir), ADC8 (bidir), ADC9 (bidir), ADC10 (bidir), ADC11 (bidir), GND (bidir), OpAmp-Power (bidir), Power-ADC (bidir), Power-Sensor (bidir)

### Nets
GND: C1.1 C2.1 C30.1 C31.1 P10.3(BOT) R1.1 R2.1 R3.1 R4.1 R5.1 R6.1 R7.1 R8.1 R13.1 R14.1 R106.1 R111.1 R113.1 R114.1 R115.1 R117.2 T9.3 T10.3 U1.4(V-) U2.4(V-) U3.4(V-) U4.4(V-) U5.4(V-) U9.4(V-) ; port GND  [project net VREF-]
@DAC-OUT: R116.2 ; port @DAC-OUT
ADC1-4-20mA: U1.1(OUT) U1.2(IN-) ; port ADC1  [project net ADC1]
ADC2-4-20mA: U1.6(IN-) U1.7(OUT) ; port ADC2  [project net ADC2]
ADC3-4-20mA: U2.1(OUT) U2.2(IN-) ; port ADC3  [project net ADC3]
ADC4-4-20mA: U2.6(IN-) U2.7(OUT) ; port ADC4  [project net ADC4]
ADC5-4-20mA: U3.1(OUT) U3.2(IN-) ; port ADC5  [project net ADC5]
ADC6-4-20mA: U3.6(IN-) U3.7(OUT) ; port ADC6  [project net ADC6]
ADC7-4-20mA: U4.1(OUT) U4.2(IN-) ; port ADC7  [project net ADC7]
ADC8-4-20mA: U4.6(IN-) U4.7(OUT) ; port ADC8  [project net ADC8]
ADC9: C1.2 R9.1 ; port ADC9
ADC10: C2.2 R10.1 ; port ADC10
ADC11: port ADC11
OpAmp-Power: R32.2 T9.1 T10.1 U1.8(V+) U2.8(V+) U3.8(V+) U4.8(V+) U5.8(V+) ; port OpAmp-Power  [project net 5-volt]
Power-ADC: P10.1(TOP) ; port Power-ADC  [project net 3.3v-ADE]
Power-Sensor: C31.2 R105.1 T1.1 T2.1 T3.1 T4.1 T5.1 T6.1 T7.1 T8.1 U9.8(V+) ; port Power-Sensor  [project net 12-volt]
NetC30_2: C30.2 R107.2 U9.5(IN+)
NetC32_1: C32.1 R112.1
NetC32_2: C32.2 C33.2 R110.2 U9.6(IN-)
NetC33_1: C33.1 R108.1 R112.2 U9.7(OUT)
NetP10_2: P10.2(TAP) R107.1 R116.1
NetQ19_1: Q19.1 R108.2
NetQ19_2: Q19.2 T20.2
NetQ19_3: Q19.3 R109.1 R113.2 R114.2 R115.2
NetR1_2: R1.2 T1.2 U1.3(IN+)
NetR2_2: R2.2 T2.2 U1.5(IN+)
NetR3_2: R3.2 T3.2 U2.3(IN+)
NetR4_2: R4.2 T4.2 U2.5(IN+)
NetR5_2: R5.2 T5.2 U3.3(IN+)
NetR6_2: R6.2 T6.2 U3.5(IN+)
NetR7_2: R7.2 T7.2 U4.3(IN+)
NetR8_2: R8.2 T8.2 U4.5(IN+)
NetR9_2: R9.2 U5.1(OUT) U5.2(IN-)
NetR10_2: R10.2 R31.1 U5.7(OUT)
NetR11_1: R11.1 T9.2
NetR11_2: R11.2 R13.2 U5.3(IN+)
NetR12_1: R12.1 T10.2
NetR12_2: R12.2 R14.2 U5.5(IN+)
NetR31_2: R31.2 R32.1 R117.1 U5.6(IN-)
NetR104_1: R104.1 R106.2 U9.2(IN-)
NetR104_2: R104.2 R110.1 U9.1(OUT)
NetR105_2: R105.2 T20.1
NetR109_2: R109.2 R111.2 U9.3(IN+)

### Notes on the sheet
- PC0
- PC1
- PC2
- PC3
- PA0
- PA1
- PA2
- PA3
- PA4
- PA5
- PA6
- (near R31) This removed
- (near R9) This removed
- 2.7V = 20mA
- 20mA->100mV

### Library data of the parts
C1 C2 C30-C33 = CAP SMD 0805: CAP 0805; Designer: Abbas Basereh; Desc.: CAP SMD 0805; Data: 16-12-2016
P10 = Multi-Turn: Potentiometer
Q19 = NPN
R1-R14 R31 R32 R104-R117 = RES 0805 0.125W: as R23 on sheet Main; Data: 16-12-2016
T1-T8 T20 = CON_Phoenix_MSTB_02: as T23 on sheet Outputs; Category: Connector; ComponentLink1Description: Header, Nominal current: 12 A Rated voltage (III/2): 320 V Number of positions: 2 Pitch: 5.08 mm Color: green Contact surface: Tin Assembly: Soldering  DESIGNER:ABBAS BASEREH; ComponentLink2Description: Reference; Mounting Technology: Through-Hole; Pin Count: 2; Revision 1: 2017-3-1; Status: Unreleased; PART.NO: PHOENIX
T9 T10 = CON_Phoenix_MSTB_03: 3 Pitch: 5.08 mm Color: green Contact surface: Tin Assembly; Manufacturer: PHOENIX CONTACT; Connector type: PCB Terminal Block; designer: ABBAS BASEREH; Max Current: 12 A; Positions: 3; Voltage: 320 V; Category: Connector; ComponentLink1Description: Header, Nominal current: 12 A Rated voltage (III/2): 320 V Number of positions: 3 Pitch: 5.08 mm Color: green Contact surface: Tin Assembly: Soldering  DESIGNER:ABBAS BASEREH; ComponentLink2Description: Reference; Mounting Technology: Through-Hole; Pin Count: 3; Revision 1: 2017-3-1; Status: Unreleased; PART.NO: PHOENIX
U1-U5 U9 = LM358D: Dual Low-Power Operational Amplifier; Published: 17-Jul-2002; LatestRevisionDate: 13-Apr-2006; LatestRevisionNote: IPC-7351 Footprint Added.; DatasheetVersion: 1988; PackageReference: 751-02; Publisher: Altium Limited; PackageDescription: 8-Pin Small Outline Integrated Circuit 1.27 mm Pitch; Code_JEDEC: MS-012-AA; Code_IPC: SOIC127P600-8; ComponentLink1Description: Manufacturer Link; ComponentLink1URL: http://www.onsemi.com/site/products/parametrics/0,4446,251,00.html; ComponentLink2Description: Datasheet; ComponentLink2URL: http://www.onsemi.com/pub/Collateral/LM358-D.PDF

## Sheet Digital_Input.SchDoc
size A3 portrait
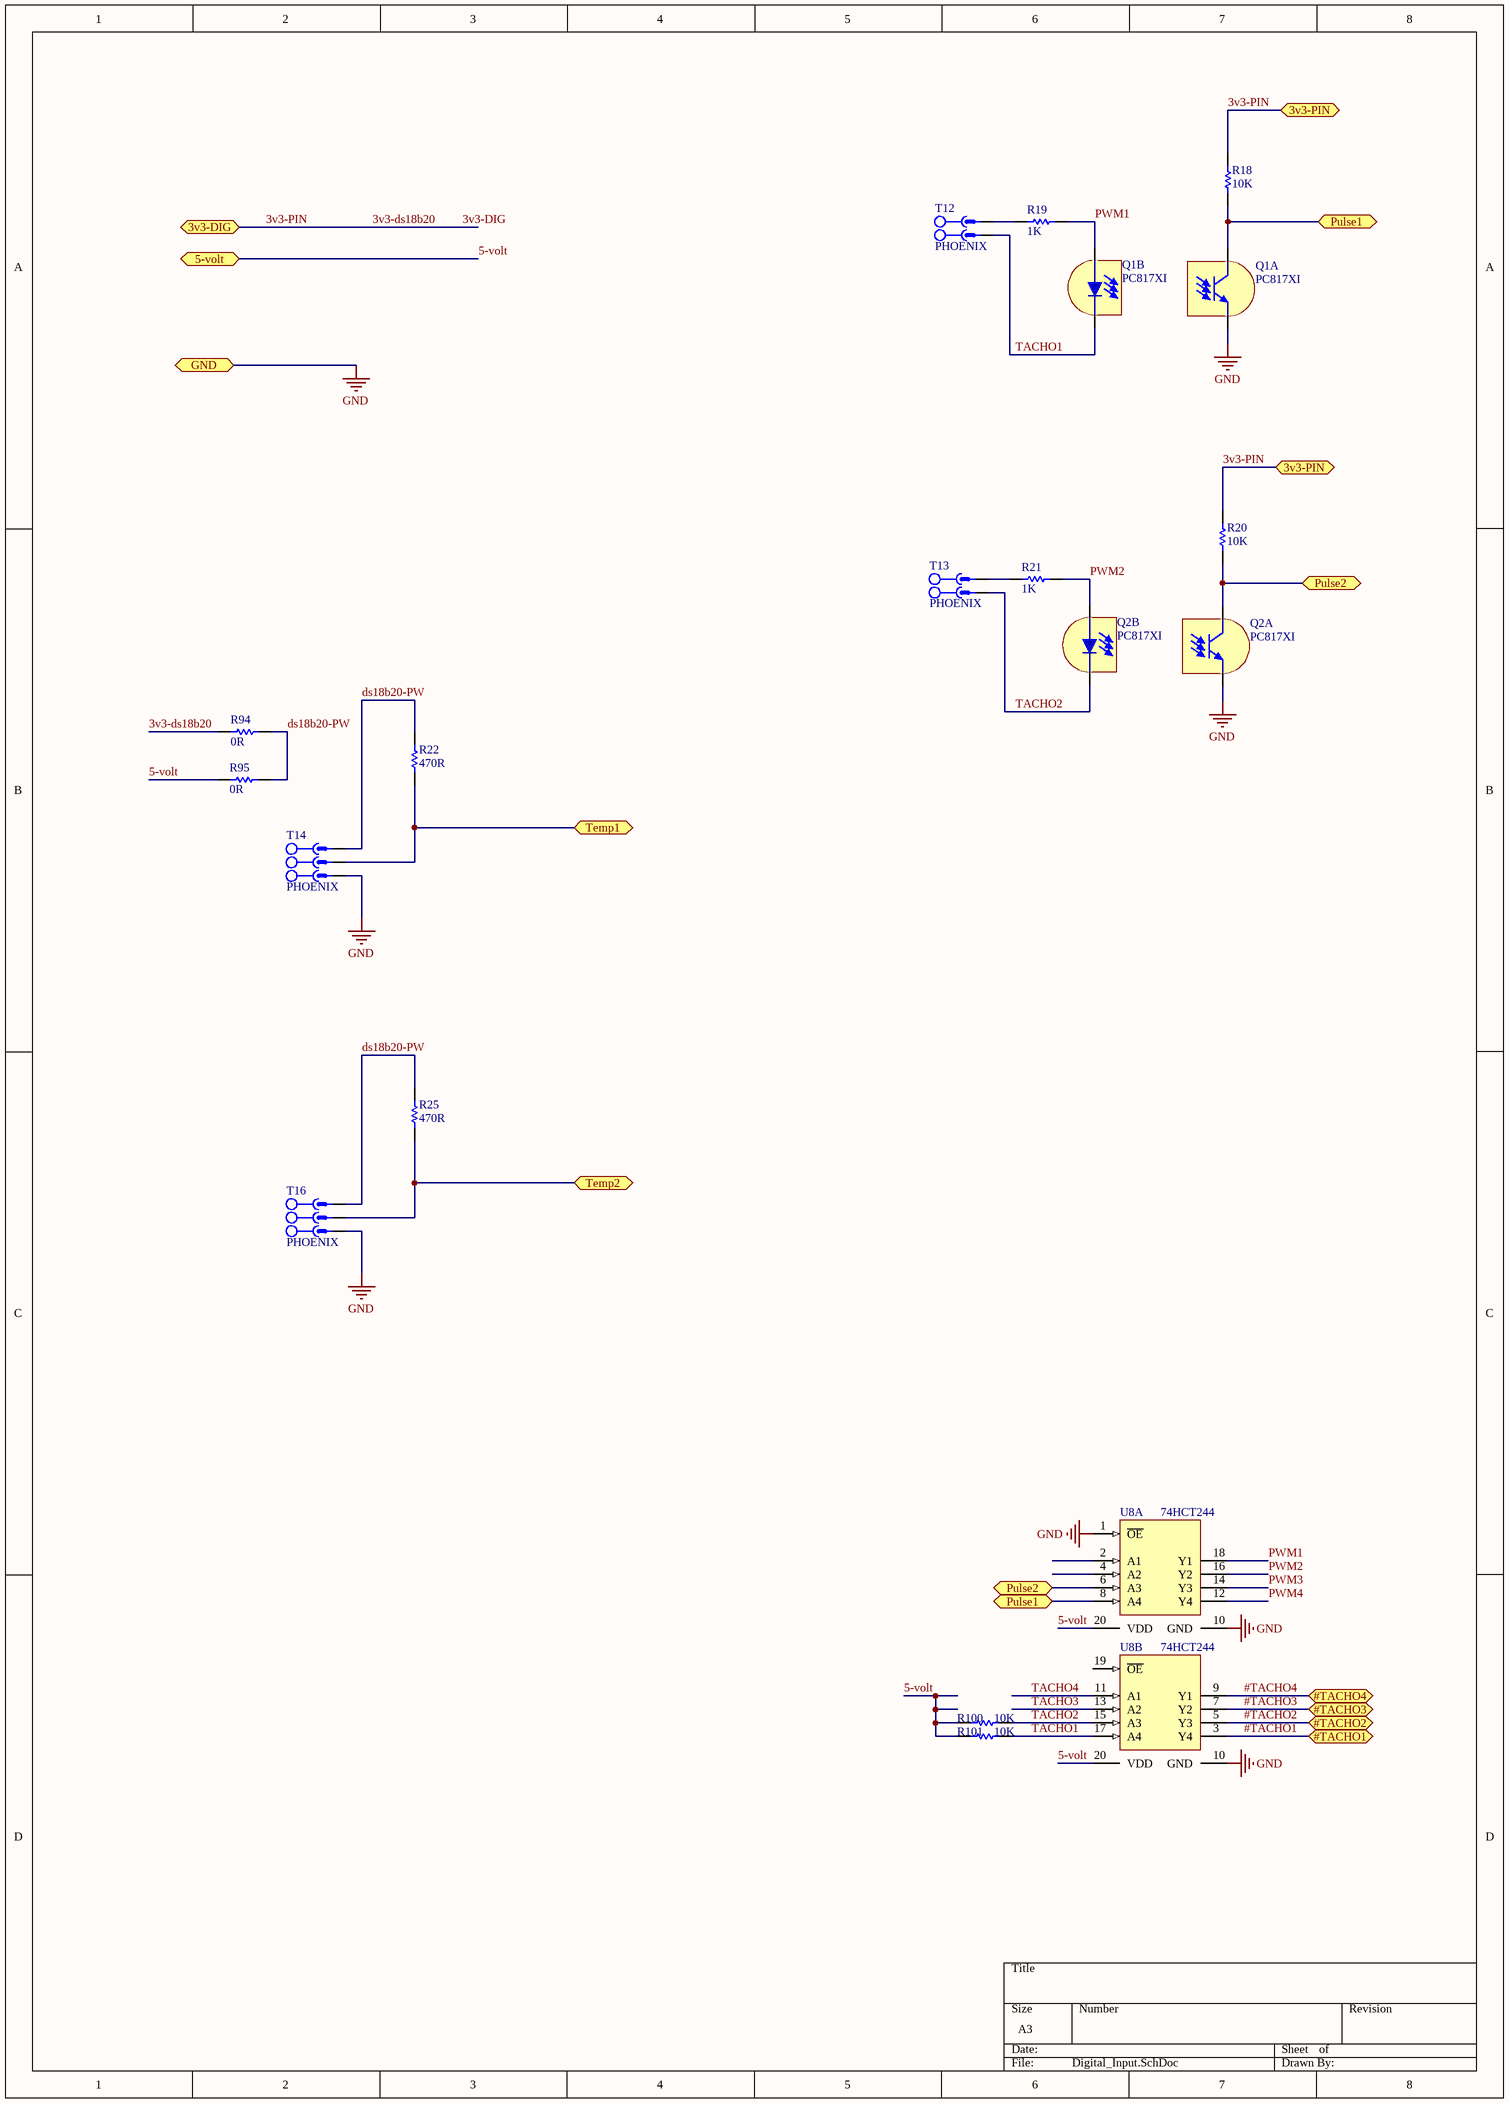
[diagram p11: Digital_Input.SchDoc]

### Parts
Q1  PC817XI  [SMT Gullwing Lead-Form]  (parts A,B of 2)
Q2  PC817XI  [SMT Gullwing Lead-Form]  (parts A,B of 2)
R18  10K  [RESC3413X04N]
R19  1K  [RESC3413X04N]
R20  10K  [RESC3413X04N]
R21  1K  [RESC3413X04N]
R22  470R  [RESC3413X04N]
R25  470R  [RESC3413X04N]
R94  0R  [0805_R]
R95  0R  [0805_R]
R100  10K  [RESC3413X04N]
R101  10K  [RESC3413X04N]
T12  PHOENIX  [MSTB 2,5/2-G-5,08]
T13  PHOENIX  [MSTB 2,5/2-G-5,08]
T14  PHOENIX  [MSTB 2,5/3-G-5,08]
T16  PHOENIX  [MSTB 2,5/3-G-5,08]
U8  74HCT244  [SSOP20_M]  (parts A,B of 2)

### Ports
3v3-DIG (bidir), 3v3-PIN (bidir), 5-volt (bidir), #TACHO1 (bidir), #TACHO2 (bidir), #TACHO3 (bidir), #TACHO4 (bidir), GND (bidir), Pulse1 (bidir), Pulse2 (bidir), Temp1 (bidir), Temp2 (bidir)

### Nets
GND: Q1.3(E) Q2.3(E) T14.1 T16.1 U8.1(~{OE}) U8.10(GND) ; port GND  [project net VREF-]
3v3-DIG: R18.2 R20.2 R94.2 ; port 3v3-PIN, port 3v3-DIG  [also labelled 3v3-ds18b20, 3v3-PIN]  [project net 3.3v-ADE]
5-volt: R95.2 R100.2 R101.2 U8.20(VDD) ; port 5-volt
#TACHO1: U8.3(Y4) ; port #TACHO1
#TACHO2: U8.5(Y3) ; port #TACHO2
#TACHO3: U8.7(Y2) ; port #TACHO3
#TACHO4: U8.9(Y1) ; port #TACHO4
ds18b20-PW: R22.2 R25.2 R94.1 R95.1 T14.3 T16.3
Pulse1: Q1.4(C) R18.1 U8.8(A4) ; port Pulse1
Pulse2: Q2.4(C) R20.1 U8.6(A3) ; port Pulse2
PWM1: Q1.1(A) R19.2 U8.18(Y1)
PWM2: Q2.1(A) R21.2 U8.16(Y2)
PWM3: U8.14(Y3)
PWM4: U8.12(Y4)
TACHO1: Q1.2(K) R101.1 T12.1 U8.17(A4)
TACHO2: Q2.2(K) R100.1 T13.1 U8.15(A3)
TACHO3: U8.13(A2)
TACHO4: U8.11(A1)
Temp1: R22.1 T14.2 ; port Temp1
Temp2: R25.1 T16.2 ; port Temp2
NetR19_1: R19.1 T12.2
NetR21_1: R21.1 T13.2

Not connected (* = marked no-connect by the designer): U8 2(A1) 4(A2) 19(~{OE})

### Library data of the parts
Q1 Q2 = PC817XI: DIP 4pin General Purpose  Photocoupler; Published: 2017-2-27; DatasheetVersion: 2017-2-27; PackageVersion: 2017-2-27; PackageReference: SMT Gullwing Lead-Form; Publisher: Abbas Basereh; PackageDescription: SOP, 4-Leads, Body 4/65x6/75mm, Pitch 2/54mm, IPC Medium Density designer:abbas basereh; ComponentLink1Description: Manufacturer Link; ComponentLink1URL: http://www.roboeq.ir/files/id/233/name/PC817.pdf/; ComponentLink2Description: DIP 4pin General Purpose
R18-R22 R25 R94 R95 R100 R101 = RES 0805 0.125W: as R23 on sheet Main; Data: 16-12-2016
T12 T13 = CON_Phoenix_MSTB_02: as T23 on sheet Outputs; Category: Connector; ComponentLink1Description: Header, Nominal current: 12 A Rated voltage (III/2): 320 V Number of positions: 2 Pitch: 5.08 mm Color: green Contact surface: Tin Assembly: Soldering  DESIGNER:ABBAS BASEREH; ComponentLink2Description: Reference; Mounting Technology: Through-Hole; Pin Count: 2; Revision 1: 2017-3-1; Status: Unreleased; PART.NO: PHOENIX
T14 T16 = CON_Phoenix_MSTB_03: as T9 on sheet Analog_Input; Category: Connector; ComponentLink1Description: Header, Nominal current: 12 A Rated voltage (III/2): 320 V Number of positions: 3 Pitch: 5.08 mm Color: green Contact surface: Tin Assembly: Soldering  DESIGNER:ABBAS BASEREH; ComponentLink2Description: Reference; Mounting Technology: Through-Hole; Pin Count: 3; Revision 1: 2017-3-1; Status: Unreleased; PART.NO: PHOENIX
U8 = MC74HC244AN: Octal 3-State Non-Inverting Buffer/Line Driver/Line Receiver; Published: 15-Apr-2002; DatasheetVersion: Mar-2000; PackageVersion: 1996; PackageReference: 738-03; Publisher: Altium Limited; PackageDescription: DIP; 20 Leads; Row Spacing 7.62 mm; Pitch 2.54 mm; Code_JEDEC: MS-001-AD; ComponentLink1Description: Manufacturer Link; ComponentLink1URL: http://www.onsemi.com/; ComponentLink2Description: Datasheet; ComponentLink2URL: http://www.onsemi.com/pub/Collateral/MC74HC244A-D.PDF

## Sheet Power.SchDoc
size A3
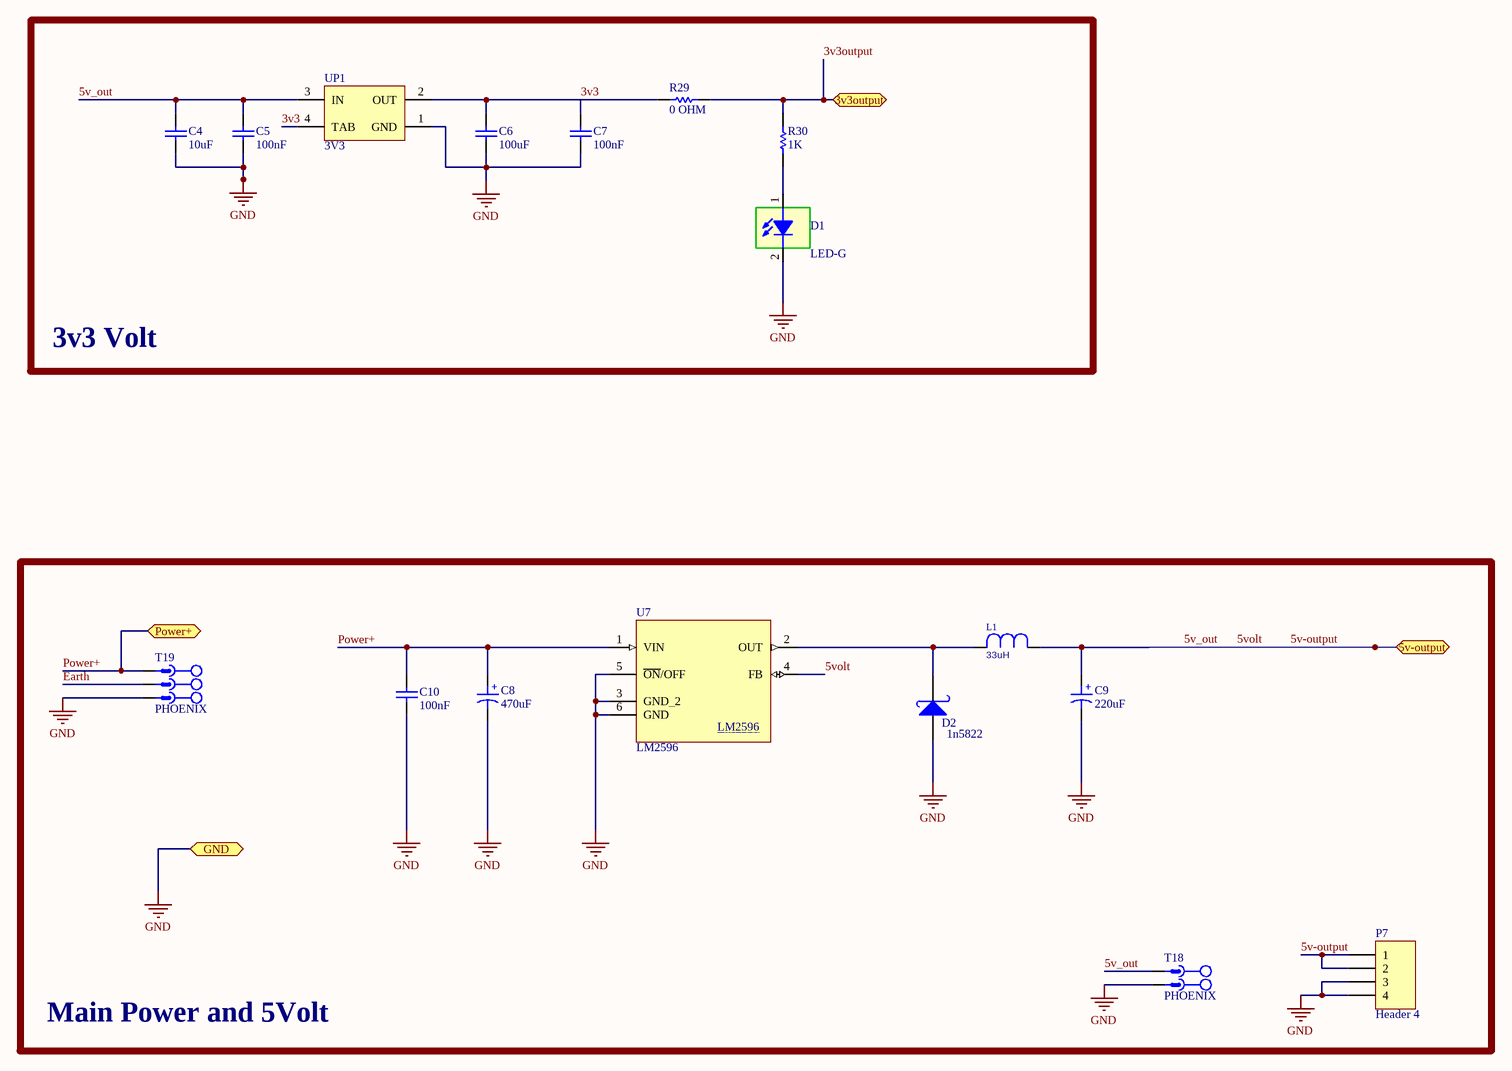
[diagram p12: Power.SchDoc]

### Parts
C4  10uF  [CAPC4817X12N]
C5  100nF  [CAPC3413X12N]
C6  100uF  [CAPC4817X12N]
C7  100nF  [CAPC3413X12N]
C8  470uF  [CAP SMD 470uF]
C9  220uF  [CAP SMD 470uF]
C10  100nF  [CAPC3413X12N]
D1  LED-G  [LED 1206]
D2  1n5822  [DO-214AB(SMC)]
L1  33uH  [CDRH127]
P7  Header 4  [HDR1X4]
R29  0 OHM  [RESC3413X04N]
R30  1K  [RESC3413X04N]
T18  PHOENIX  [MSTB 2,5/2-G-5,08]
T19  PHOENIX  [MSTB 2,5/3-G-5,08]
U7  LM2596  [TO170P1524X483-6N]
UP1  3V3  [SOT223_N]

### Blocks framed on the sheet
3v3 Volt: C4-C7 D1 R29 R30 UP1
Main Power and 5Volt: C8-C10 D2 L1 P7 T18 T19 U7

### Ports
3v3output (bidir), 5v-output (bidir), GND (bidir), Power+ (bidir)

### Nets
GND: C4.1 C5.1 C6.1 C7.1 C8.2 C9.2 C10.1 D1.2 D2.1(A) P7.3 P7.4 T18.1 T19.3 U7.3(GND_2) U7.5(~{ON}/OFF) U7.6(GND) UP1.1(GND) ; port GND  [project net VREF-]
3v3: C6.2 C7.2 R29.1 UP1.2(OUT) UP1.4(TAB)
3v3output: R29.2 R30.2 ; port 3v3output  [project net 3.3v-ADE]
5v-output: C4.2 C5.2 C9.1 L1.1 P7.1 P7.2 T18.2 U7.4(FB) UP1.3(IN) ; port 5v-output  [also labelled 5v_out, 5volt]  [project net 5-volt]
Earth: T19.2
Power+: C8.1 C10.2 T19.1 U7.1(VIN) ; port Power+  [project net 12-volt]
NetD1_1: D1.1 R30.1
NetD2_2: D2.2(K) L1.2 U7.2(OUT)

### Notes on the sheet
- (in symbol Cap ELECTROLITIC TOTAL SIZE) +

### Library data of the parts
C4 C6 = CAP SMD 1206: CAP 1206; Designer: Abbas Basereh; Desc.: CAP SMD 1206; Data: 16-12-2016
C5 C7 C10 = CAP SMD 0805: CAP 0805; Designer: Abbas Basereh; Desc.: CAP SMD 0805; Data: 16-12-2016
C8 = Cap ELECTROLITIC TOTAL SIZE: Cap electrolitic radial; Designer: Abbas Basereh; Data: 16-12-2016; Part. No: *; VALUE: 470uF
C9 = Cap ELECTROLITIC TOTAL SIZE: as C41 on sheet Main; Data: 16-12-2016; Part. No: *
D1 = LED SMD 1206: SMD 1206 LED
D2 = 1N5822 SMD: Schottky Rectifiers; Part. No: SS34; Manufacturer: ON Semiconductor/Fairchild; Designer: Abbas Basereh; Link: https://www.aliexpress.com/item/Free-shipping-100pcs-1n5822-sma-smd-do-214ac-Schottky-diode-ss34/32337482329.html?spm=2114.01010208.3.1.zLZDsP&ws_ab_test=searchweb0_0,searchweb201602_4_10065_10068_10084_10083_10080_10082_10081_10060_10061_10062_10056_10055_10054_10059_10099_10078_10079_427_10073_10103_10102_10096_10052_10050_10051,searchweb201603_4&btsid=6e50dc92-ac69-45bc-a19e-209af19ce602; Link: http://www.tme.eu/en/details/ss34/smd-schottky-diodes/vishay/ss34-e357t/; Link: http://www.digikey.com/product-detail/en/on-semiconductor-fairchild/SS34/SS34FSCT-ND/2094459; Data: 16-12-2016
L1 = L_CDRH127: Inductor; Value: 33uH
P7 = Header 4: Header, 4-Pin; LatestRevisionDate: 17-Jul-2002; LatestRevisionNote: Re-released for DXP Platform.; Publisher: Altium Limited
R29 R30 = RES 0805 0.125W: as R23 on sheet Main; Data: 16-12-2016
T18 = CON_Phoenix_MSTB_02: as T23 on sheet Outputs; Category: Connector; ComponentLink1Description: Header, Nominal current: 12 A Rated voltage (III/2): 320 V Number of positions: 2 Pitch: 5.08 mm Color: green Contact surface: Tin Assembly: Soldering  DESIGNER:ABBAS BASEREH; ComponentLink2Description: Reference; Mounting Technology: Through-Hole; Pin Count: 2; Revision 1: 2017-3-1; Status: Unreleased; PART.NO: PHOENIX
T19 = CON_Phoenix_MSTB_03: as T9 on sheet Analog_Input; Category: Connector; ComponentLink1Description: Header, Nominal current: 12 A Rated voltage (III/2): 320 V Number of positions: 3 Pitch: 5.08 mm Color: green Contact surface: Tin Assembly: Soldering  DESIGNER:ABBAS BASEREH; ComponentLink2Description: Reference; Mounting Technology: Through-Hole; Pin Count: 3; Revision 1: 2017-3-1; Status: Unreleased; PART.NO: PHOENIX
UP1 = AMS1117-x.x: x.x Volt, 800mA Low-Dropout Linear Regulator, 4-pin SOT-223; Designer: Ali Hafizi; Data: 16-12-2016

## Sheet Communication.SchDoc
size B portrait; Organization: Protel International P/L; Address1: L3, 12a Rodborough Rd; Address2: Frenchs Forest; Address3: NSW; Address4: Australia 2086
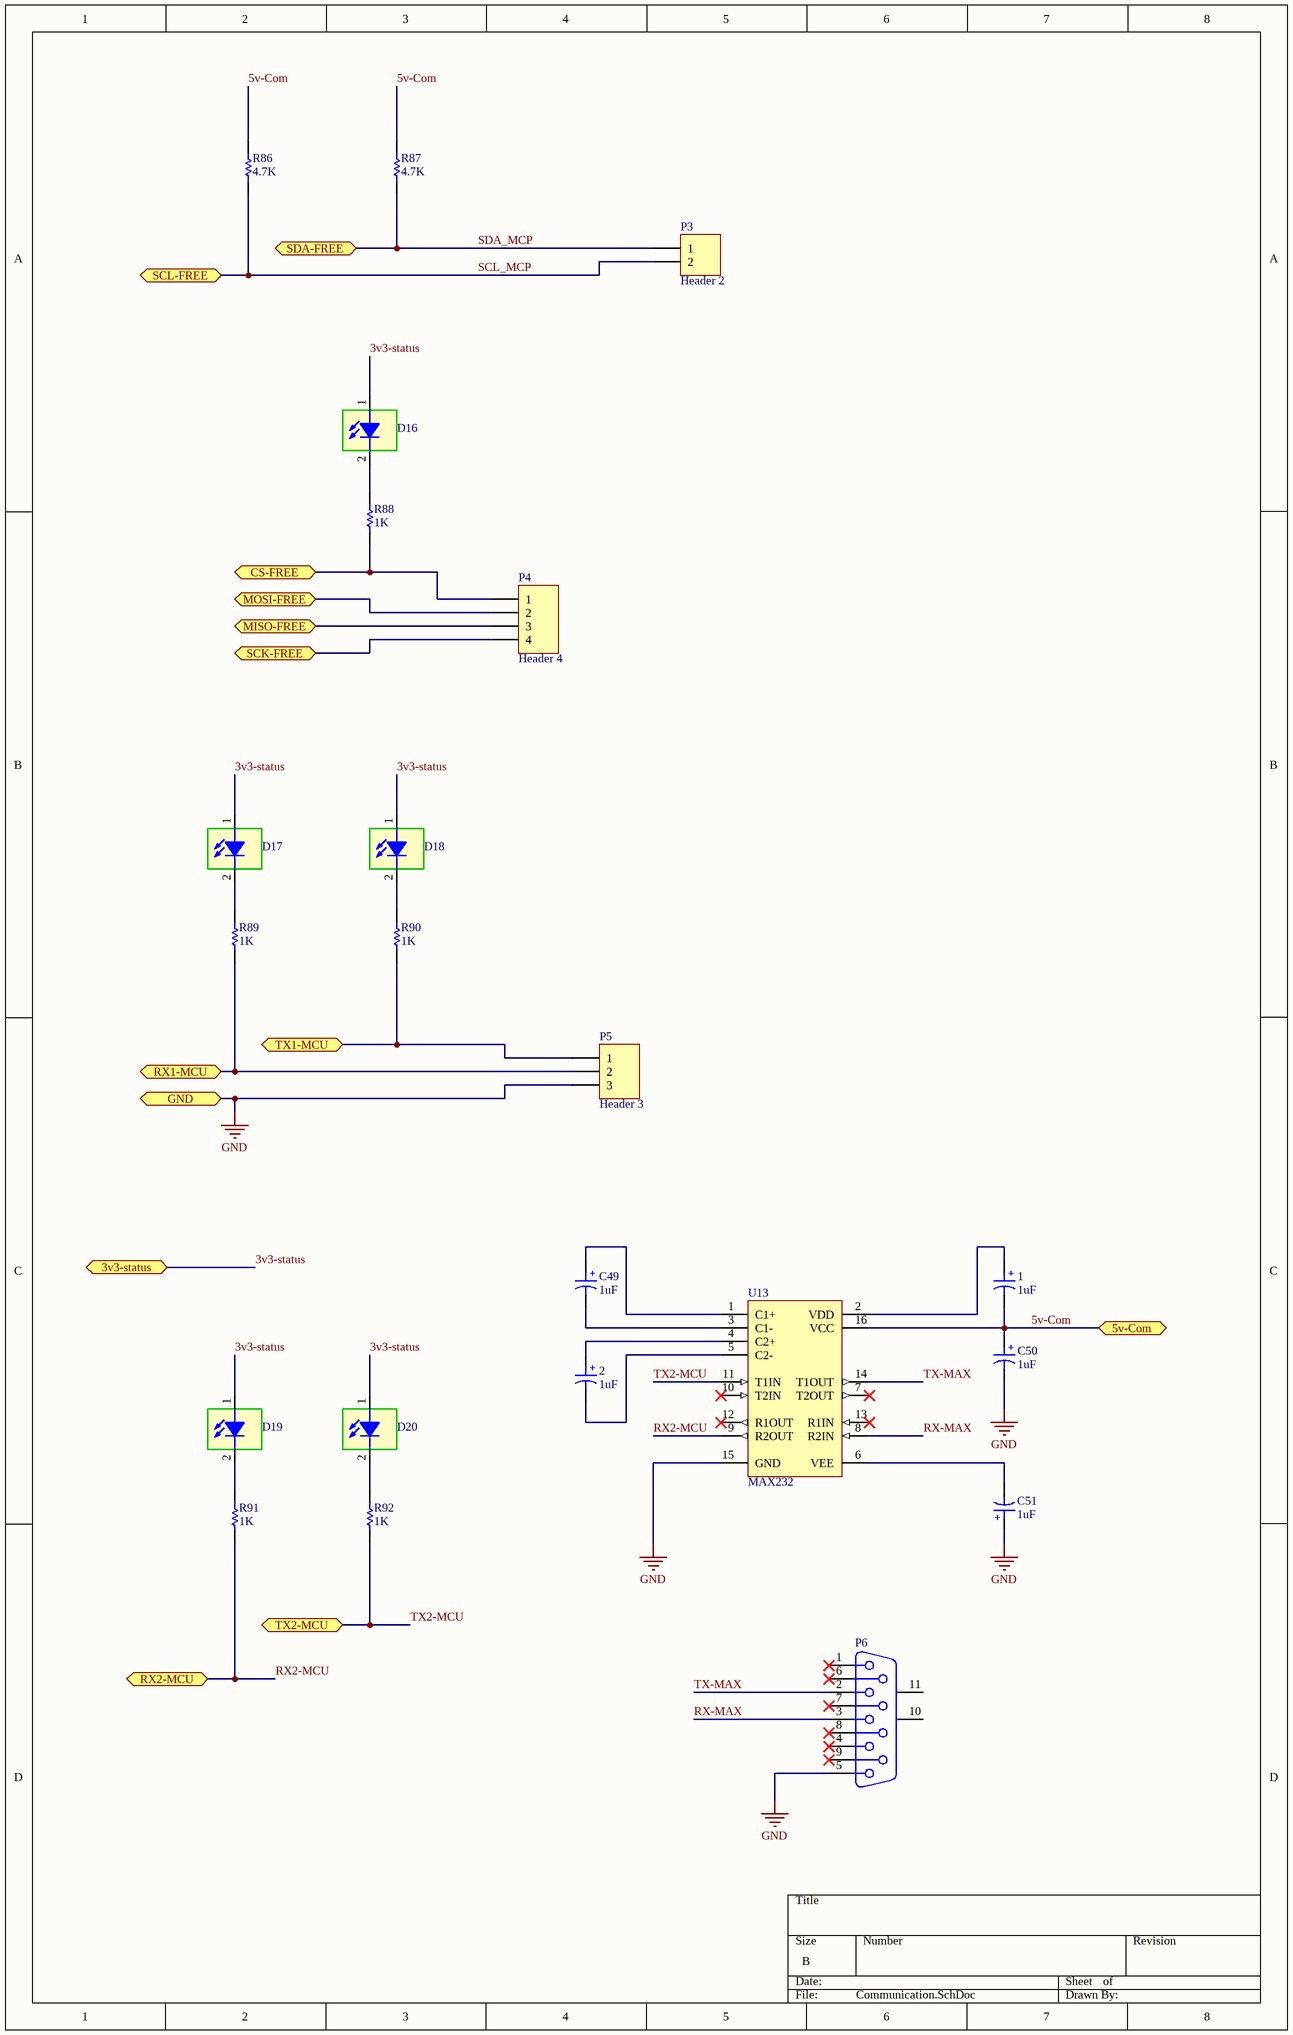
[diagram p13: Communication.SchDoc]

### Parts
1  1uF  [Cap1206_(3216X18L)Size A]
2  1uF  [Cap1206_(3216X18L)Size A]
C49  1uF  [Cap1206_(3216X18L)Size A]
C50  1uF  [Cap1206_(3216X18L)Size A]
C51  1uF  [Cap1206_(3216X18L)Size A]
D16  SMD 1206 LED  [LED 1206]  (value not drawn)
D17  SMD 1206 LED  [LED 1206]  (value not drawn)
D18  SMD 1206 LED  [LED 1206]  (value not drawn)
D19  SMD 1206 LED  [LED 1206]  (value not drawn)
D20  SMD 1206 LED  [LED 1206]  (value not drawn)
P3  Header 2  [HDR1X2]
P4  Header 4  [HDR1X4]
P5  Header 3  [HDR1X3]
P6  DB9 Connector  [DB9 Female]  (value not drawn)
R86  4.7K  [RESC3413X04N]
R87  4.7K  [RESC3413X04N]
R88  1K  [RESC3413X04N]
R89  1K  [RESC3413X04N]
R90  1K  [RESC3413X04N]
R91  1K  [RESC3413X04N]
R92  1K  [RESC3413X04N]
U13  MAX232  [SOIC-16]

### Ports
3v3-status (bidir), 5v-Com (bidir), CS-FREE (bidir), GND (bidir), MISO-FREE (bidir), MOSI-FREE (bidir), RX1-MCU (bidir), RX2-MCU (bidir), SCK-FREE (bidir), SCL-FREE (bidir), SDA-FREE (bidir), TX1-MCU (bidir), TX2-MCU (bidir)

### Nets
GND: C50.2 C51.1 P5.3 P6.5 U13.15(GND) ; port GND  [project net VREF-]
3v3-status: D16.1 D17.1 D18.1 D19.1 D20.1 ; port 3v3-status  [project net 3.3v-ADE]
5v-Com: 1.2 C50.1 R86.2 R87.2 U13.16(VCC) ; port 5v-Com  [project net 5-volt]
CS-FREE: P4.1 R88.1 ; port CS-FREE
MISO-FREE: P4.3 ; port MISO-FREE
MOSI-FREE: P4.2 ; port MOSI-FREE
RX1-MCU: P5.2 R89.1 ; port RX1-MCU
RX2-MCU: R91.1 U13.9(R2OUT) ; port RX2-MCU
RX-MAX: P6.3 U13.8(R2IN)
SCK-FREE: P4.4 ; port SCK-FREE
SCL_MCP: P3.2 R86.1 ; port SCL-FREE  [project net SCL-FREE]
SDA_MCP: P3.1 R87.1 ; port SDA-FREE  [project net SDA-FREE]
TX1-MCU: P5.1 R90.1 ; port TX1-MCU
TX2-MCU: R92.1 U13.11(T1IN) ; port TX2-MCU
TX-MAX: P6.2 U13.14(T1OUT)
Net1_1: 1.1 U13.2(VDD)
Net2_1: 2.1 U13.4(C2+)
Net2_2: 2.2 U13.5(C2-)
NetC49_1: C49.1 U13.1(C1+)
NetC49_2: C49.2 U13.3(C1-)
NetC51_2: C51.2 U13.6(VEE)
NetD16_2: D16.2 R88.2
NetD17_2: D17.2 R89.2
NetD18_2: D18.2 R90.2
NetD19_2: D19.2 R91.2
NetD20_2: D20.2 R92.2

Not connected (* = marked no-connect by the designer): P6 1* 4* 6* 7* 8* 9* 10(MH1) 11(MH2); U13 7(T2OUT)* 10(T2IN)* 12(R1OUT)* 13(R1IN)*

### Notes on the sheet
- Title
- Size:
- Date:
- B
- Number:
- Time:
- Revision:
- Sheet
- of
- File:
- (in symbol Cap ELECTROLITIC TOTAL SIZE) +

### Library data of the parts
1 2 C49-C51 = Cap ELECTROLITIC TOTAL SIZE: as C8 on sheet Power; Data: 16-12-2016; Part. No: *; VALUE: 1uF
D16-D20 = LED SMD 1206
P3 = Header 2: Header, 2-Pin; LatestRevisionDate: 17-Jul-2002; LatestRevisionNote: Re-released for DXP Platform.; Publisher: Altium Limited
P4 = Header 4: Header, 4-Pin; LatestRevisionDate: 17-Jul-2002; LatestRevisionNote: Re-released for DXP Platform.; Publisher: Altium Limited
P5 = Header 3: Header, 3-Pin; LatestRevisionDate: 17-Jul-2002; LatestRevisionNote: Re-released for DXP Platform.; Publisher: Altium Limited
P6 = DB9 Connector: Receptacle Assembly, 9 Position, Right Angle; PackageDocument: O; Positions: 9; Published: 15-Jun-2001; LatestRevisionDate: 17-Jul-2002; LatestRevisionNote: Re-released for DXP Platform.; DatasheetDocument: 1-Sep-1999; PackageReference: 788750; Publisher: Altium Limited; Orientation: Right Angle; Gender: Receptacle
R86-R92 = RES 0805 0.125W: as R23 on sheet Main; Data: 16-12-2016
U13 = MAX232: +5V Powered RS-232 Driver/Receiver; Published: 16-Jan-2001; LatestRevisionDate: 06-Jun-2005; LatestRevisionNote: Stylized 3D Model Added.; DatasheetVersion: Apr-1992; PackageVersion: 1997; PackageReference: PE16A; Publisher: Altium Limited; PackageDescription: DIP; 16 Leads; Row Spacing 7.62 mm; Pitch 2.54 mm; Code_JEDEC: MS-001-BB; ComponentLink1Description: Manufacturer Link; ComponentLink1URL: http://www.maxim-ic.com/; ComponentLink2Description: Datasheet; ComponentLink2URL: http://pdfserv.maxim-ic.com/en/ds/MAX220-MAX249.pdf

## Nets that join several sheets
VREF-: Main (40 pins), PowerMeter (30 pins), Outputs (9 pins), Analog_Input (29 pins), Digital_Input (6 pins), Power (17 pins), Communication (5 pins)
3.3v-ADE: Main (32 pins), PowerMeter (6 pins), Analog_Input (P10.1), Digital_Input (R18.2 R20.2 R94.2), Power (R29.2 R30.2), Communication (5 pins)
5-volt: Main (LCD1.2 P1.1 R23.2 U10.15), Analog_Input (8 pins), Digital_Input (R95.2 R100.2 R101.2 U8.20), Power (9 pins), Communication (5 pins)
12-volt: Outputs (U11.2), Analog_Input (11 pins), Power (C8.1 C10.2 T19.1 U7.1)
#TACHO1: Main (U12.40), Digital_Input (U8.3)
#TACHO2: Main (U12.42), Digital_Input (U8.5)
#TACHO3: Main (U12.44), Digital_Input (U8.7)
#TACHO4: Main (U12.45), Digital_Input (U8.9)
@DAC-OUT: Main (U12.30), Analog_Input (R116.2)
ADC1: Main (U12.15), Analog_Input (U1.1 U1.2)
ADC2: Main (U12.16), Analog_Input (U1.6 U1.7)
ADC3: Main (U12.17), Analog_Input (U2.1 U2.2)
ADC4: Main (U12.18), Analog_Input (U2.6 U2.7)
ADC5: Main (U12.23), Analog_Input (U3.1 U3.2)
ADC6: Main (U12.24), Analog_Input (U3.6 U3.7)
ADC7: Main (U12.25), Analog_Input (U4.1 U4.2)
ADC8: Main (U12.26), Analog_Input (U4.6 U4.7)
ADC9: Main (U12.33), Analog_Input (C1.2 R9.1)
ADC10: Main (U12.34), Analog_Input (C2.2 R10.1)
CS-ADE: Main (U12.51), PowerMeter (U6.39)
CS-FREE: Main (U12.82), Communication (P4.1 R88.1)
IRQ0-ADE: Main (U12.60), PowerMeter (U6.29)
IRQ1-ADE: Main (U12.59), PowerMeter (U6.32)
MCU-o1: Main (U12.2), Outputs (R47.1)
MCU-o2: Main (U12.3), Outputs (R50.1)
MCU-o3: Main (U12.4), Outputs (R51.1)
MCU-o4: Main (U12.5), Outputs (R52.1)
MCU-o5: Main (U12.98), Outputs (R53.1)
MCU-o6: Main (U12.1), Outputs (R17.1)
MCU-o7: Main (U12.89), Outputs (R57.1)
MCU-o8: Main (U12.90), Outputs (R58.1)
MISO-ADE: Main (U12.53), PowerMeter (U6.37)
MISO-FREE: Main (U10.22 U12.79), Communication (P4.3)
MOSI-ADE: Main (U12.54), PowerMeter (U6.38)
MOSI-FREE: Main (U10.21 U12.80), Communication (P4.2)
Pulse1: Main (U12.36), Digital_Input (Q1.4 R18.1 U8.8)
Pulse2: Main (U12.35), Digital_Input (Q2.4 R20.1 U8.6)
RX1-MCU: Main (U12.93), Communication (P5.2 R89.1)
RX2-MCU: Main (U12.87), Communication (R91.1 U13.9)
SCK-ADE: Main (U12.52), PowerMeter (U6.36)
SCK-FREE: Main (U10.23 U12.78), Communication (P4.4)
SCL-FREE: Main (U12.95), Communication (P3.2 R86.1)
SDA-FREE: Main (U12.96), Communication (P3.1 R87.1)
Temp1: Main (R102.1 R103.1), Digital_Input (R22.1 T14.2)
Temp2: Main (U12.64), Digital_Input (R25.1 T16.2)
TX1-MCU: Main (U12.92), Communication (P5.1 R90.1)
TX2-MCU: Main (U12.86), Communication (R92.1 U13.11)